# Altium project CryptUS_Daughterboard_Rev1_A.PrjPcb (part 1 of 2)
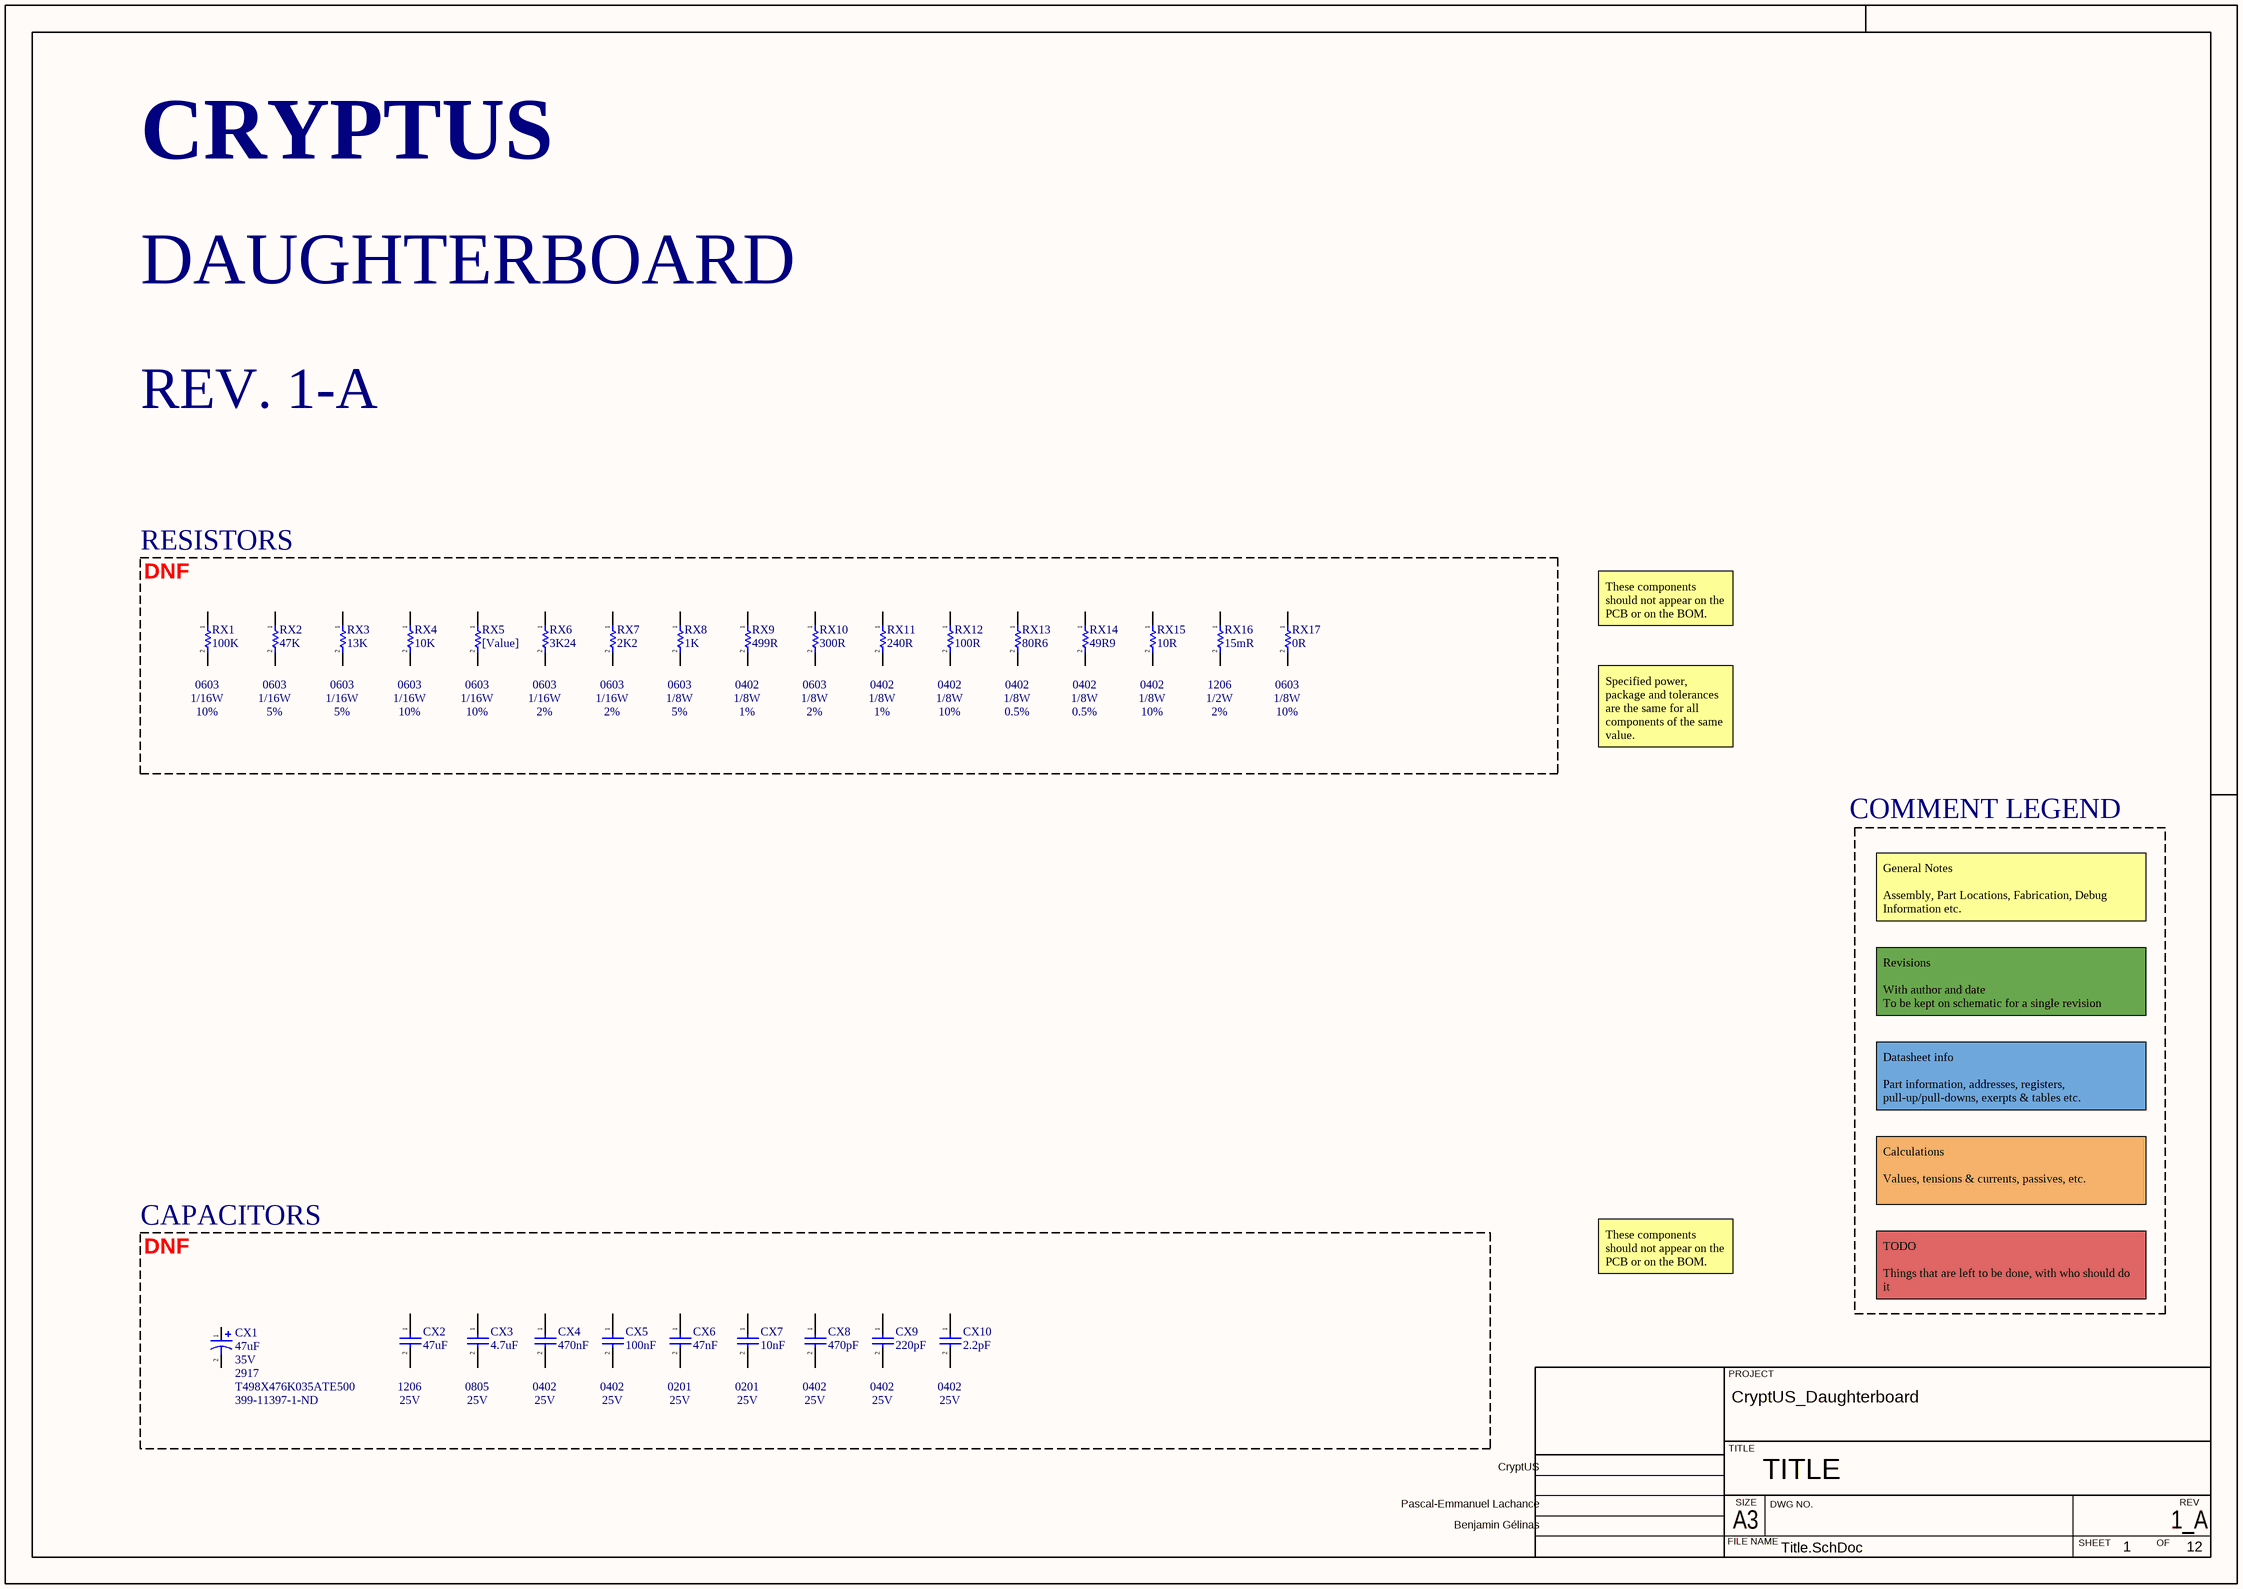
[diagram p0: Title.SchDoc]
ItemRevision: 1_A; NotFitted: DNF; Project: CryptUS_Daughterboard
12 sheets, 499 parts. Net scope: strictly hierarchical (ports join the sheet entries above them; power ports are local).
Board file: Daughterboard_Rev1_A.PcbDoc
Sheets:
  Title.SchDoc
  Overview.SchDoc
    FPGA = FPGA IO.SchDoc
    JTAG & FLASH = FPGA PERIPHERALS.SchDoc
    FPGA POWER = FPGA Power.SchDoc
    CONNECTORS = Mechanical and Interconnect.SchDoc
    DDR3 POWER REGULATOR = DDR3 Regulators.SchDoc
    MEM POWER 0 = DDR3 Power.SchDoc
    MEM 0 = DDR3.SchDoc
    DDR3 TERMINATION = DDR3 Termination.SchDoc
    USB0 = USB.SchDoc
    FPGA POWER REGULATOR = FPGA Regulators.SchDoc

## Sheet Title.SchDoc: TITLE
size 420 x 297 mm; Address1: CryptUS; Address3: Pascal-Emmanuel Lachance; Address4: Benjamin Gélinas; SheetNumber: 1; SheetTotal: 12

### Parts
CX1  47uF  Part #: T498X476K035ATE500  Rated Voltage: 35V  Supplier Part Number 1: 399-11397-1-ND  Package: 2917  [CAP_2917_P]
CX2  47uF  [CAP_1206]
CX3  4.7uF  [CAP_0805]
CX4  470nF  [CAP_0402]
CX5  100nF  [CAP_0402]
CX6  47nF  [CAP_0201]
CX7  10nF  [CAP_0201]
CX8  470pF  [CAP_0402]
CX9  220pF  [CAP_0402]
CX10  2.2pF  [CAP_0402]
RX1  100K  [RES_0603]
RX2  47K  [RES_0603]
RX3  13K  [RES_0603]
RX4  10K  [RES_0603]
RX5  [Value]  [RES_0603]
RX6  3K24  [RES_0603]
RX7  2K2  [RES_0603]
RX8  1K  [RES_0603]
RX9  499R  [RES_0402]
RX10  300R  [RES_0603]
RX11  240R  [RES_0402]
RX12  100R  [RES_0402]
RX13  80R6  [RES_0402]
RX14  49R9  [RES_0402]
RX15  10R  [RES_0402]
RX16  15mR  [RES_1206]
RX17  0R  [RES_0603]

### Blocks framed on the sheet
RESISTORS: RX1-RX17
CAPACITORS: CX1-CX10

### Nets

Not connected (* = marked no-connect by the designer): CX1 1 2; CX2 1 2; CX3 1 2; CX4 1 2; CX5 1 2; CX6 1 2; CX7 1 2; CX8 1 2; CX9 1 2; CX10 1 2; RX1 1 2; RX2 1 2; RX3 1 2; RX4 1 2; RX5 1 2; RX6 1 2; RX7 1 2; RX8 1 2; RX9 1 2; RX10 1 2; RX11 1 2; RX12 1 2; RX13 1 2; RX14 1 2; RX15 1 2; RX16 1 2; RX17 1 2

### Notes on the sheet
- CRYPTUS
- DAUGHTERBOARD
- REV. 1-A
- These components should not appear on the PCB or on the BOM.
- (near RX1) 0603
- (near RX1) 1/16W
- 10%
- (near RX2) 0603
- (near RX2) 1/16W
- 5%
- (near RX3) 0603
- (near RX3) 1/16W
- (near RX4) 0603
- (near RX4) 1/16W
- (near RX5) 0603
- (near RX5) 1/16W
- (near RX6) 0603
- (near RX6) 1/16W
- 2%
- (near RX7) 0603
- (near RX7) 1/16W
- (near RX8) 0603
- (near RX8) 1/8W
- (near RX9) 0402
- (near RX9) 1/8W
- 1%
- (near RX10) 0603
- (near RX10) 1/8W
- (near RX11) 0402
- (near RX11) 1/8W
- (near RX12) 0402
- (near RX12) 1/8W
- (near RX13) 0402
- (near RX13) 1/8W
- 0.5%
- (near RX14) 0402
- (near RX14) 1/8W
- (near RX15) 0402
- (near RX15) 1/8W
- (near RX16) 1206
- (near RX16) 1/2W
- (near RX17) 0603
- (near RX17) 1/8W
- Specified power, package and tolerances are the same for all components of the same value.
- COMMENT LEGEND
- General Notes
  Assembly, Part Locations, Fabrication, Debug Information etc.
- Revisions
  With author and date
  To be kept on schematic for a single revision
- Datasheet info
  Part information, addresses, registers, pull-up/pull-downs, exerpts & tables etc.
- Calculations
  Values, tensions & currents, passives, etc.
- TODO
  Things that are left to be done, with who should do it
- (near CX2) 1206
- (near CX2) 25V
- (near CX3) 0805
- (near CX3) 25V
- (near CX4) 0402
- (near CX4) 25V
- (near CX5) 0402
- (near CX5) 25V
- (near CX6) 0201
- (near CX6) 25V
- (near CX7) 0201
- (near CX7) 25V
- (near CX8) 0402
- (near CX8) 25V
- (near CX9) 0402
- (near CX9) 25V
- (near CX10) 0402
- (near CX10) 25V
- PROJECT
- TITLE
- FILE NAME
- A3
- SIZE
- DWG NO.
- SHEET
- OF
- REV

### Library data of the parts
CX1 = CAP_T498X476K035ATE500: 47 µF Molded Tantalum Capacitors 35 V 2917 (7343 Metric) 500mOhm; Mfr: KEMET; Tolerance: 10%; Operating Temperature: -55C - 150C; Supplier 1: Digi-Key
CX2-CX10 = CAP_CER: Generic SMT Ceramic Capacitor; Voltage - Rated: 25V; Operating Temperature: *; Tolerance: *; Mfr: *; ComponentLink1Description: Digikey; ComponentLink1URL: [Digikey Link]; Digikey Part No: *; ComponentLink2Description: Datasheet; ComponentLink2URL: [Datasheet Link]
  CX2: Footprint: 1206
  CX3: Footprint: 0805
  CX4 CX5 CX8-CX10: Footprint: 0402
  CX6 CX7: Footprint: 0201
RX1 RX4 = RESISTOR: Power: 1/16W; Tolerance: 10%; Automotive: *; Operating Temperature: *; # Digikey: *; ComponentLink1Description: Digikey; ComponentLink1URL: *; # Manufacturer: *; Package / Case: 0603
RX2 RX8 = RESISTOR: Power: 1/8W; Tolerance: 5%; Automotive: *; Operating Temperature: *; # Digikey: *; ComponentLink1Description: Digikey; ComponentLink1URL: *; # Manufacturer: *; Package / Case: 0603
RX3 = RESISTOR: Power: 1/16W; Tolerance: 5%; Automotive: *; Operating Temperature: *; # Digikey: *; ComponentLink1Description: Digikey; ComponentLink1URL: *; # Manufacturer: *; Package / Case: 0603
RX5 = RESISTOR: Power: [Power]; Tolerance: [Tolerance]; Automotive: *; Operating Temperature: *; # Digikey: *; ComponentLink1Description: Digikey; ComponentLink1URL: *; # Manufacturer: *; Package / Case: [Package]
RX6 RX7 = RESISTOR: Power: 1/16W; Tolerance: 2%; Automotive: *; Operating Temperature: *; # Digikey: *; ComponentLink1Description: Digikey; ComponentLink1URL: *; # Manufacturer: *; Package / Case: 0603
RX9 RX11 = RESISTOR: Power: 1/8W; Tolerance: 1%; Automotive: *; Operating Temperature: *; # Digikey: *; ComponentLink1Description: Digikey; ComponentLink1URL: *; # Manufacturer: *; Package / Case: 0402
RX10 = RESISTOR: Power: 1/8W; Tolerance: 2%; Automotive: *; Operating Temperature: *; # Digikey: *; ComponentLink1Description: Digikey; ComponentLink1URL: *; # Manufacturer: *; Package / Case: 0603
RX12 RX15 RX17 = RESISTOR: Power: 1/8W; Tolerance: 10%; Automotive: *; Operating Temperature: *; # Digikey: *; ComponentLink1Description: Digikey; ComponentLink1URL: *; # Manufacturer: *
  RX12 RX15: Package / Case: 0402
  RX17: Package / Case: 0603
RX13 RX14 = RESISTOR: Power: 1/8W; Tolerance: 0.5%; Automotive: *; Operating Temperature: *; Package / Case: 0402; # Digikey: *; ComponentLink1Description: Digikey; ComponentLink1URL: *; # Manufacturer: *
RX16 = RESISTOR: Power: 1/2W; Tolerance: 2%; Automotive: *; Operating Temperature: *; # Digikey: *; ComponentLink1Description: Digikey; ComponentLink1URL: *; # Manufacturer: *; Package / Case: 1206

## Sheet Overview.SchDoc
size A2; SheetNumber: 2; SheetTotal: 12
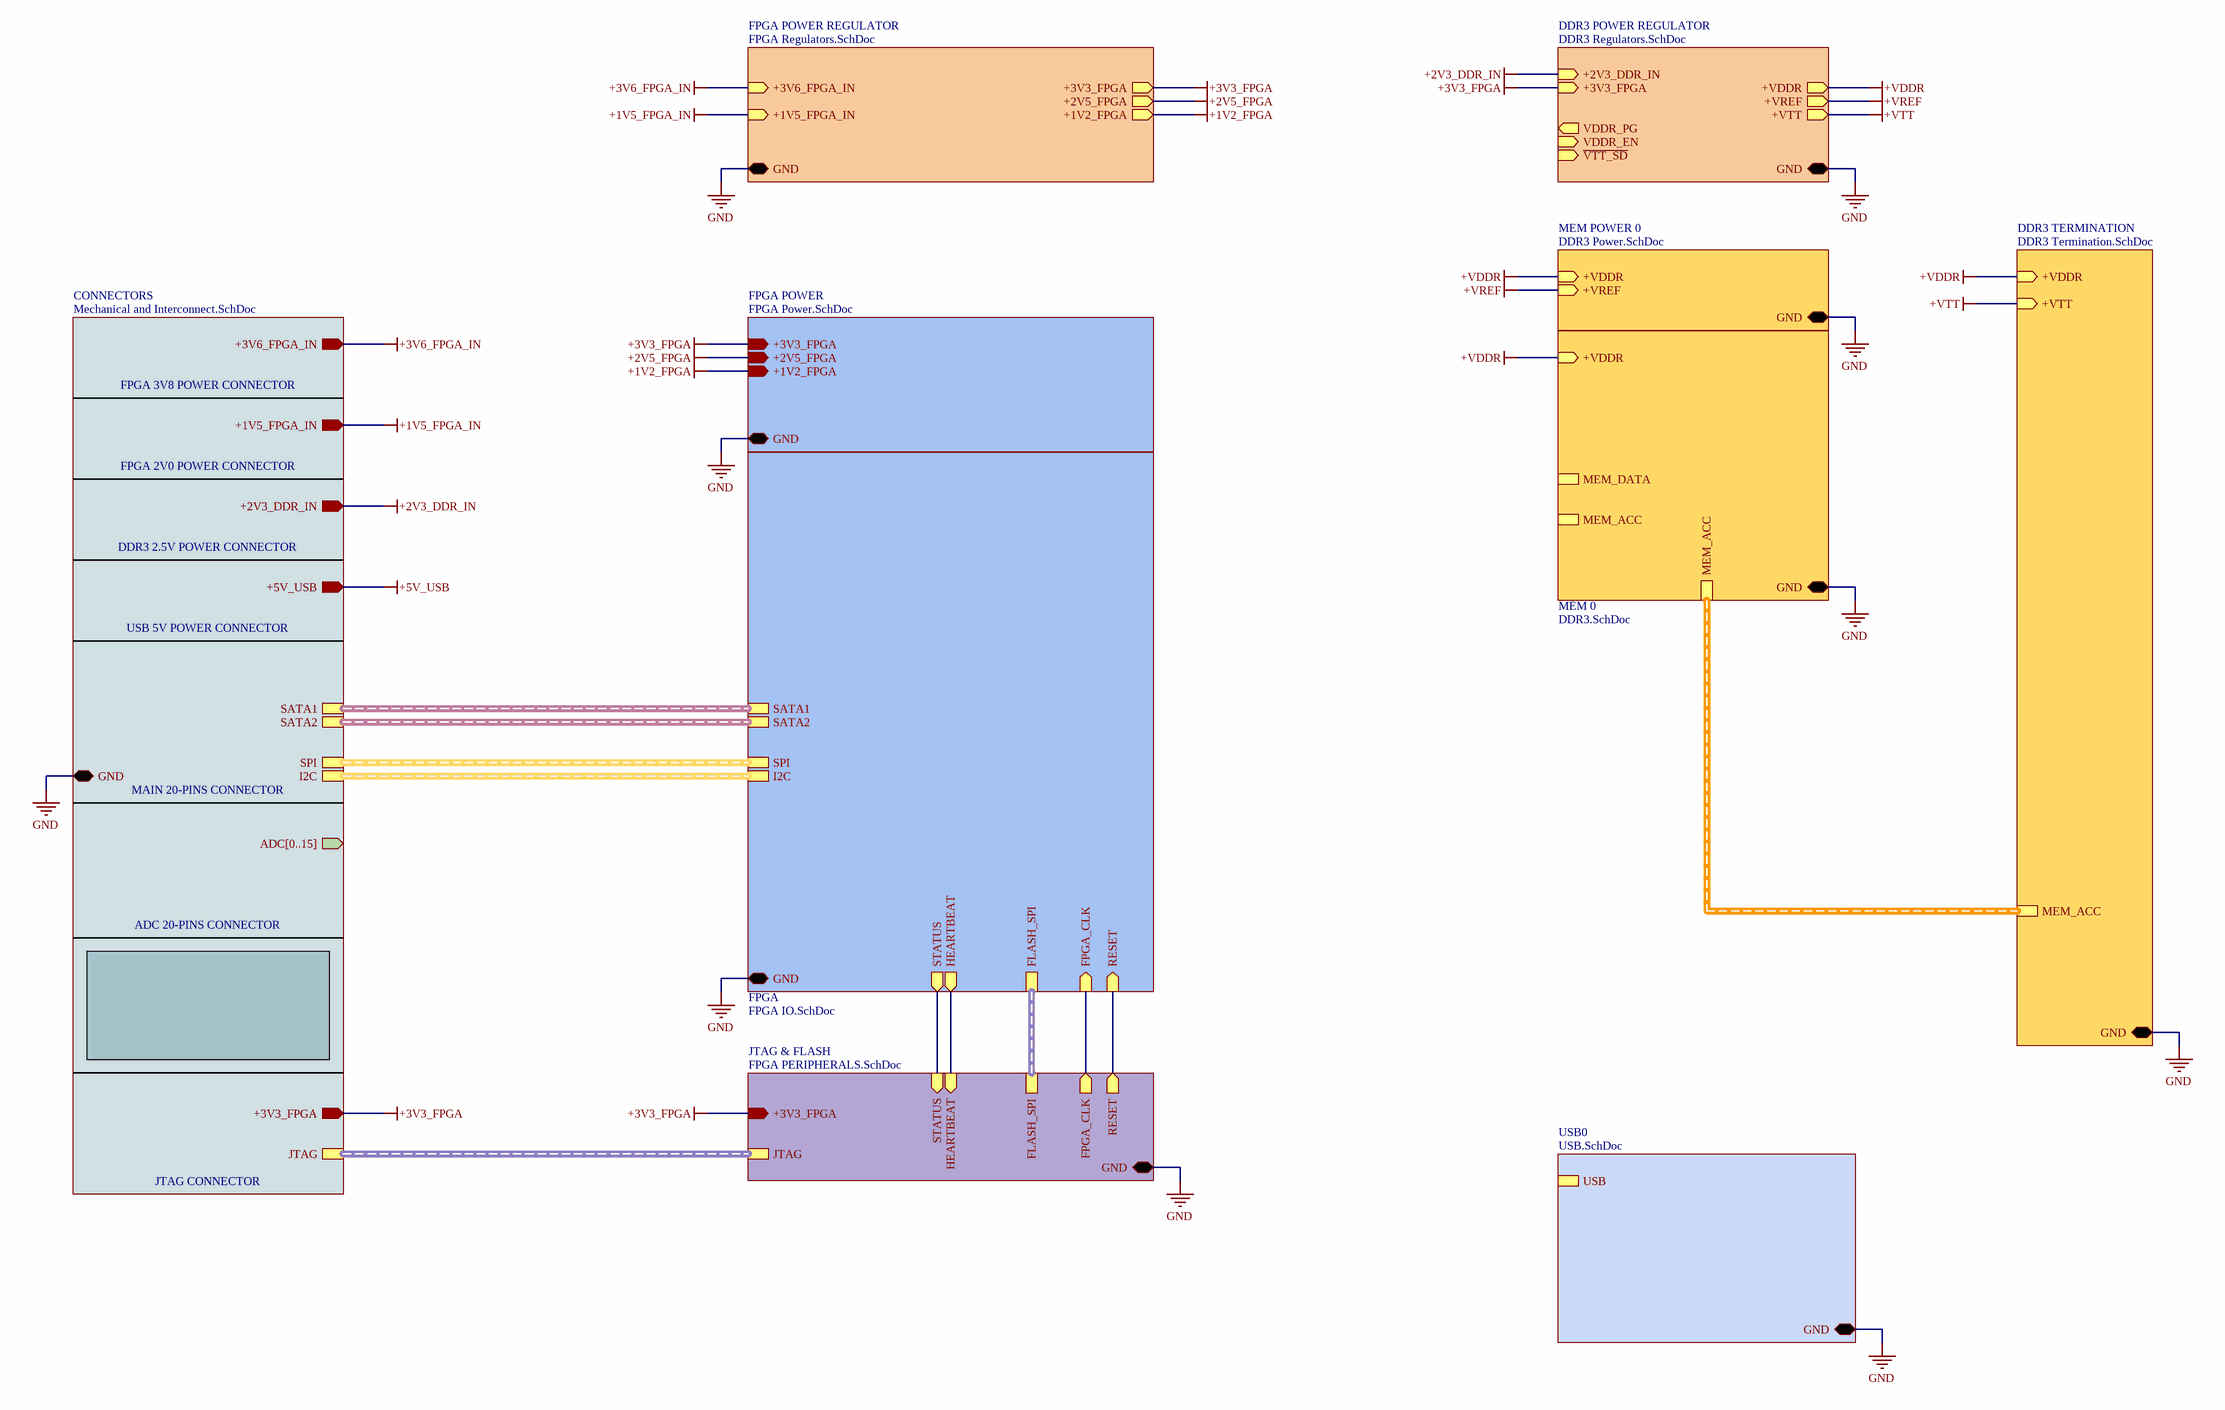
[diagram p1: Overview.SchDoc]

### Sub-sheets
CONNECTORS = Mechanical and Interconnect.SchDoc: JTAG (harness JTAG), SATA2 (harness SATA), ADC[0..15] (out), SPI (harness SPI), SATA1 (harness SATA), +5V_USB (out), +3V6_FPGA_IN (out), +3V3_FPGA (out), +2V3_DDR_IN (out), GND (bidir), I2C (harness I2C), +1V5_FPGA_IN (out)
DDR3 POWER REGULATOR = DDR3 Regulators.SchDoc: GND (bidir), VDDR_EN (in), +VDDR (out), +3V3_FPGA (in), +VREF (out), +VTT (out), ~{VTT_SD} (in), VDDR_PG (out), +2V3_DDR_IN (in)
DDR3 TERMINATION = DDR3 Termination.SchDoc: GND (bidir), +VTT (in), +VDDR (in), MEM_ACC (harness MEM_ACC)
FPGA = FPGA IO.SchDoc: FLASH_SPI (harness FLASH_SPI), GND (bidir), SATA2 (harness SATA), SPI (harness SPI), I2C (harness I2C), SATA1 (harness SATA), RESET (in), HEARTBEAT (out), STATUS (out), FPGA_CLK (in)
FPGA POWER = FPGA Power.SchDoc: GND (bidir), +3V3_FPGA (in), +2V5_FPGA (in), +1V2_FPGA (in)
FPGA POWER REGULATOR = FPGA Regulators.SchDoc: GND (bidir), +1V5_FPGA_IN (in), +3V6_FPGA_IN (in), +1V2_FPGA (out), +2V5_FPGA (out), +3V3_FPGA (out)
JTAG & FLASH = FPGA PERIPHERALS.SchDoc: JTAG (harness JTAG), FLASH_SPI (harness FLASH_SPI), +3V3_FPGA (in), GND (bidir), STATUS (in), HEARTBEAT (in), RESET (out), FPGA_CLK (out)
MEM 0 = DDR3.SchDoc: GND (bidir), +VDDR (in), MEM_DATA (harness MEM0_DATA), MEM_ACC (harness MEM_ACC), MEM_ACC (harness MEM_ACC)
MEM POWER 0 = DDR3 Power.SchDoc: GND (bidir), +VDDR (in), +VREF (in)
USB0 = USB.SchDoc: USB (harness USB), GND (bidir)

### Nets
+1V2_FPGA: sheet FPGA POWER/+1V2_FPGA, sheet FPGA POWER REGULATOR/+1V2_FPGA
+1V5_FPGA_IN: sheet CONNECTORS/+1V5_FPGA_IN, sheet FPGA POWER REGULATOR/+1V5_FPGA_IN
+2V3_DDR_IN: sheet CONNECTORS/+2V3_DDR_IN, sheet DDR3 POWER REGULATOR/+2V3_DDR_IN
+2V5_FPGA: sheet FPGA POWER/+2V5_FPGA, sheet FPGA POWER REGULATOR/+2V5_FPGA
+3V3_FPGA: sheet JTAG & FLASH/+3V3_FPGA, sheet FPGA POWER/+3V3_FPGA, sheet CONNECTORS/+3V3_FPGA, sheet DDR3 POWER REGULATOR/+3V3_FPGA, sheet FPGA POWER REGULATOR/+3V3_FPGA
+3V6_FPGA_IN: sheet CONNECTORS/+3V6_FPGA_IN, sheet FPGA POWER REGULATOR/+3V6_FPGA_IN
+VDDR: sheet DDR3 POWER REGULATOR/+VDDR, sheet MEM POWER 0/+VDDR, sheet MEM 0/+VDDR, sheet DDR3 TERMINATION/+VDDR
+VREF: sheet DDR3 POWER REGULATOR/+VREF, sheet MEM POWER 0/+VREF
+VTT: sheet DDR3 POWER REGULATOR/+VTT, sheet DDR3 TERMINATION/+VTT
GND: sheet FPGA/GND, sheet JTAG & FLASH/GND, sheet FPGA POWER/GND, sheet CONNECTORS/GND, sheet DDR3 POWER REGULATOR/GND, sheet MEM POWER 0/GND, sheet MEM 0/GND, sheet DDR3 TERMINATION/GND, sheet USB0/GND, sheet FPGA POWER REGULATOR/GND
HEARTBEAT: sheet FPGA/HEARTBEAT, sheet JTAG & FLASH/HEARTBEAT
RESET: sheet FPGA/RESET, sheet JTAG & FLASH/RESET
NetD9_2: sheet FPGA/STATUS, sheet JTAG & FLASH/STATUS
NetU1_L20: sheet FPGA/FPGA_CLK, sheet JTAG & FLASH/FPGA_CLK

### Buses and harness runs
harness sheet CONNECTORS/I2C = sheet FPGA/I2C
harness sheet CONNECTORS/JTAG = sheet JTAG & FLASH/JTAG
harness sheet CONNECTORS/SATA1 = sheet FPGA/SATA1
harness sheet CONNECTORS/SATA2 = sheet FPGA/SATA2
harness sheet CONNECTORS/SPI = sheet FPGA/SPI
harness sheet DDR3 TERMINATION/MEM_ACC = sheet MEM 0/MEM_ACC
harness sheet FPGA/FLASH_SPI = sheet JTAG & FLASH/FLASH_SPI

### Notes on the sheet
- FPGA 3V8 POWER CONNECTOR
- FPGA 2V0 POWER CONNECTOR
- DDR3 2.5V POWER CONNECTOR
- USB 5V POWER CONNECTOR
- MAIN 20-PINS CONNECTOR
- ADC 20-PINS CONNECTOR
- JTAG CONNECTOR

## Sheet FPGA IO.SchDoc
size 420 x 297 mm; SheetNumber: 4; SheetTotal: 12
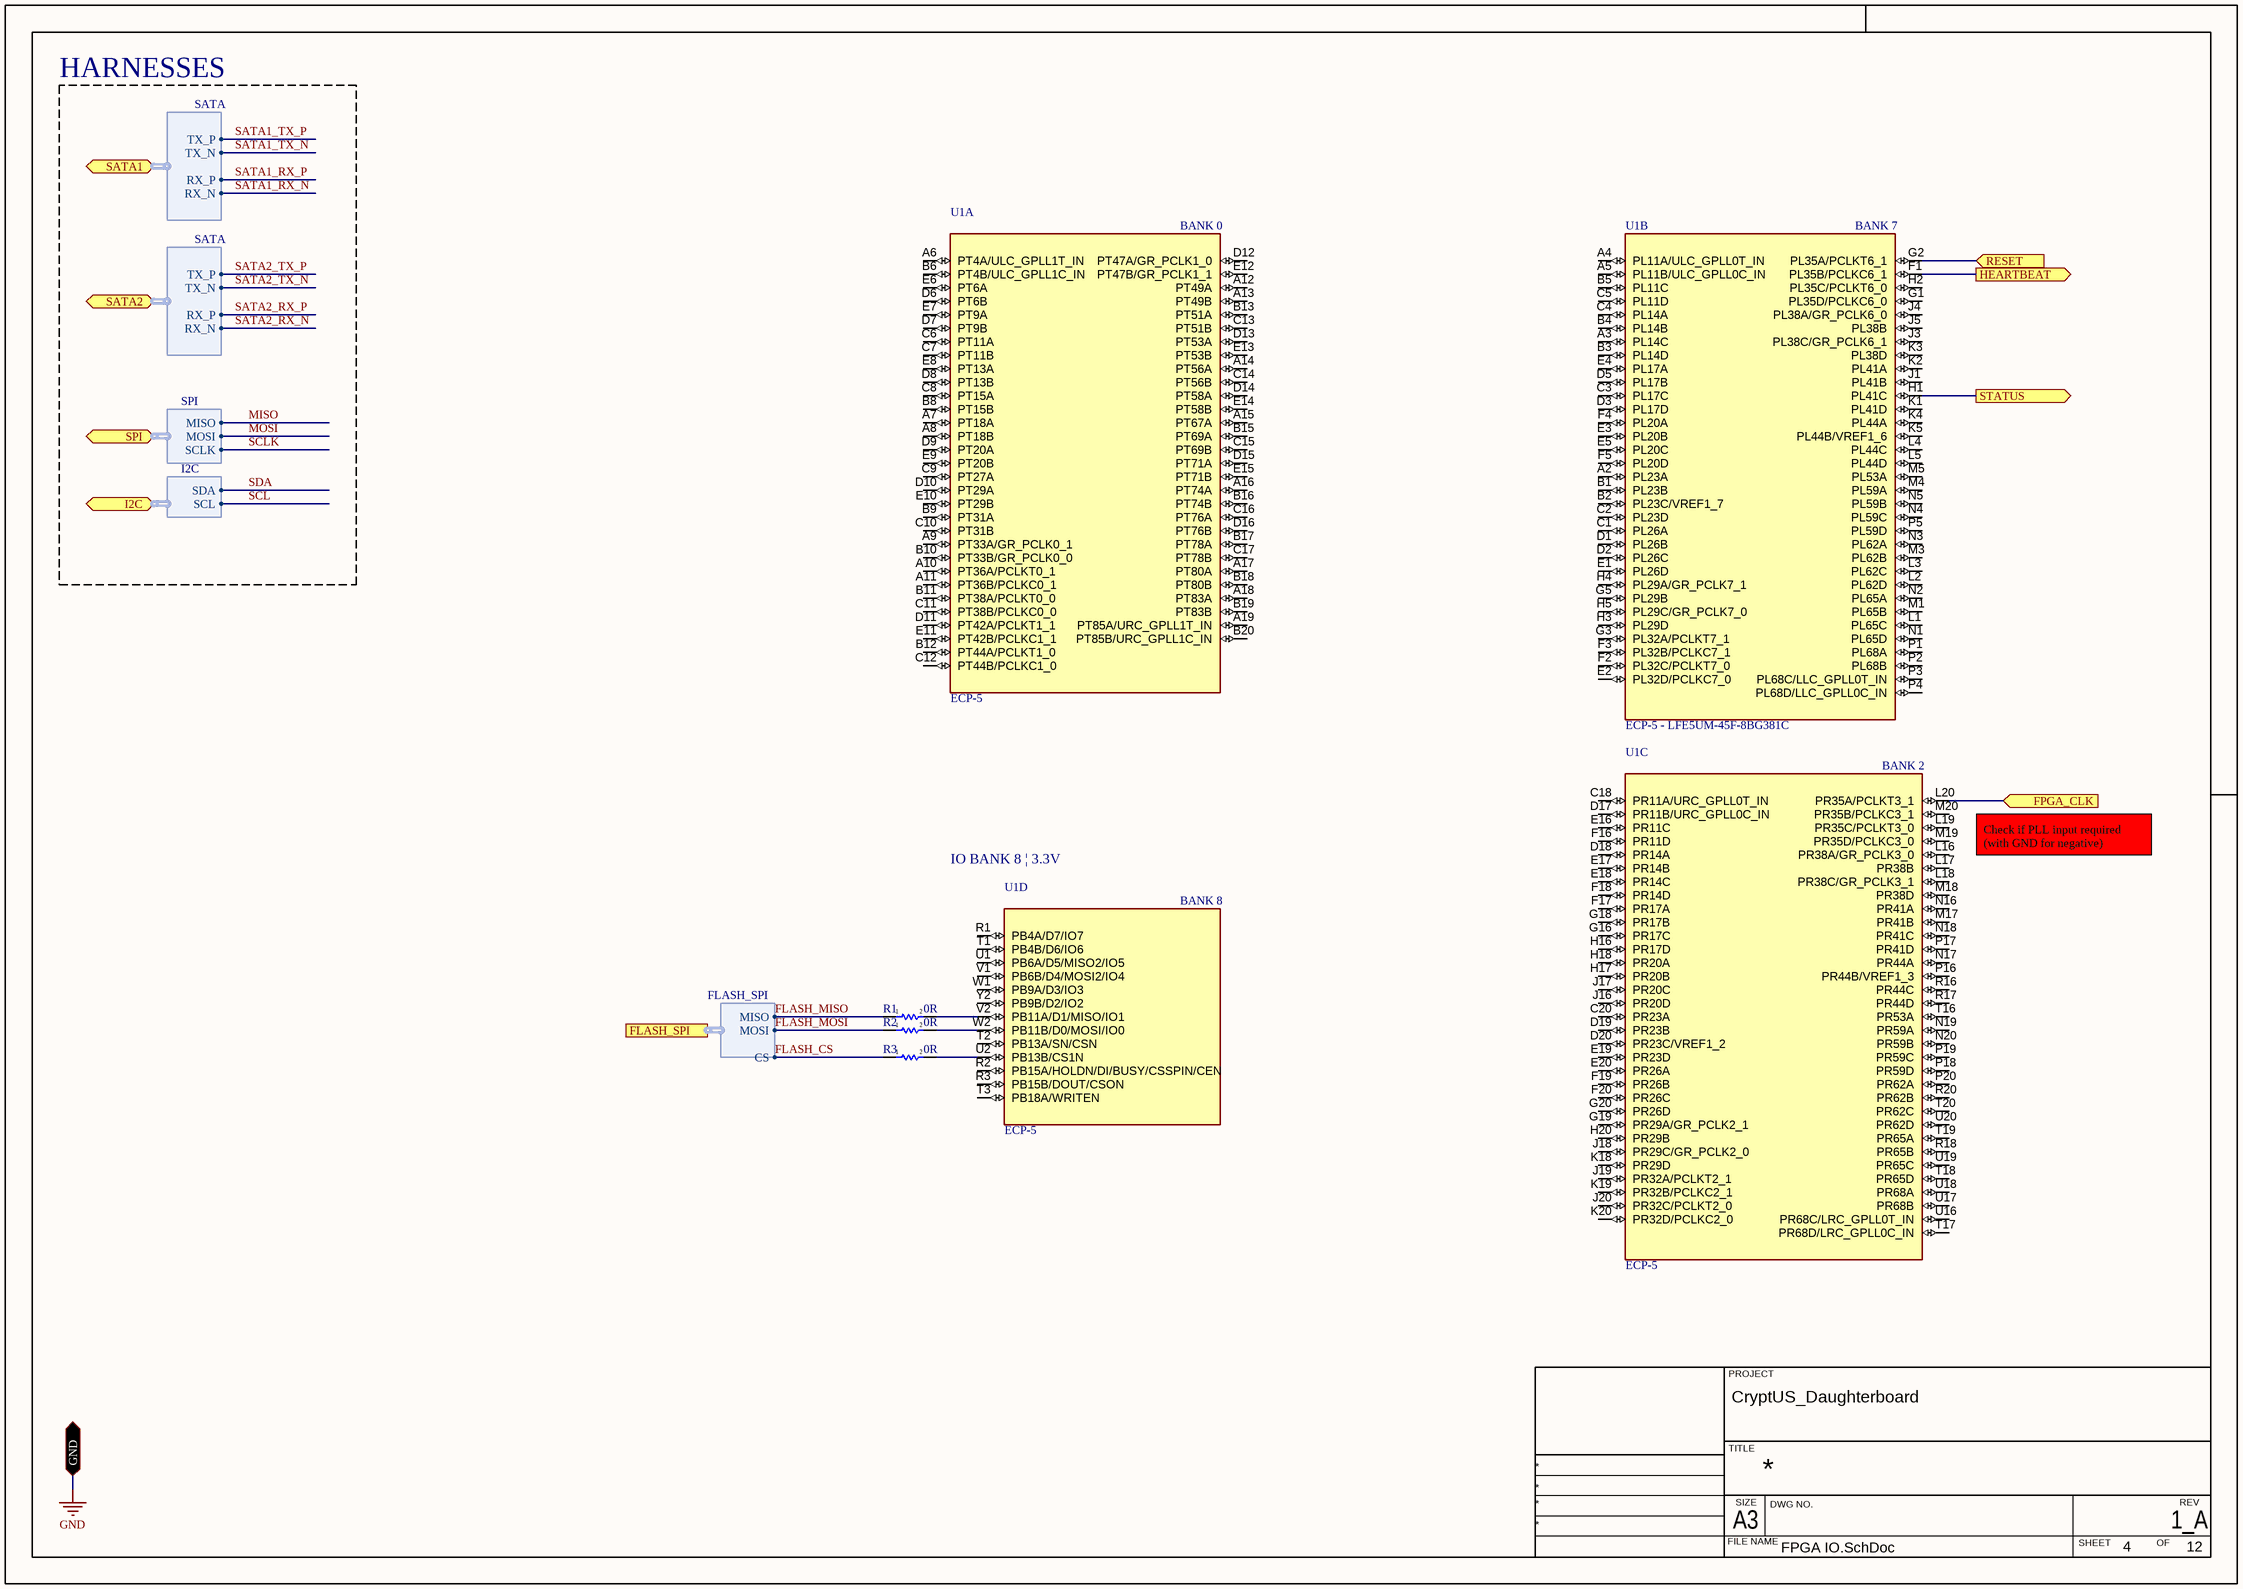
[diagram p2: FPGA IO.SchDoc]

### Parts
R1  0R  [RES_0603]
R2  0R  [RES_0603]
R3  0R  [RES_0603]
U1  ECP-5  [CABGA-381]  (parts A,B,C,D of 7)

### Ports
FLASH_SPI (harness FLASH_SPI), FPGA_CLK (in), GND (bidir), HEARTBEAT (out), I2C (bidir, harness I2C), RESET (in), SATA1 (bidir, harness SATA), SATA2 (bidir, harness SATA), SPI (bidir, harness SPI), STATUS (out)

### Harnesses
FLASH_SPI: MISO, MOSI, CS
SATA: TX_P, TX_N, RX_P, RX_N
I2C: SDA, SCL
SPI: MISO, MOSI, SCLK

### Nets
FLASH_CS: R3.1 ; port FLASH_SPI.CS
FLASH_MISO: R1.1 ; port FLASH_SPI.MISO
FLASH_MOSI: R2.1 ; port FLASH_SPI.MOSI
HEARTBEAT: U1.F1(PL35B/PCLKC6_1) ; port HEARTBEAT
RESET: U1.G2(PL35A/PCLKT6_1) ; port RESET
NetD9_2: U1.H1(PL41C) ; port STATUS
NetR1_2: R1.2 U1.V2(PB11A/D1/MISO/IO1)
NetR2_2: R2.2 U1.W2(PB11B/D0/MOSI/IO0)
NetR3_2: R3.2 U1.U2(PB13B/CS1N)
NetU1_L20: U1.L20(PR35A/PCLKT3_1) ; port FPGA_CLK

Not connected (* = marked no-connect by the designer): U1 A2(PL23A) A3(PL14C) A4(PL11A/ULC_GPLL0T_IN) A5(PL11B/ULC_GPLL0C_IN) A6(PT4A/ULC_GPLL1T_IN) A7(PT18A) A8(PT18B) A9(PT33A/GR_PCLK0_1) A10(PT36A/PCLKT0_1) A11(PT36B/PCLKC0_1) A12(PT49A) A13(PT49B) A14(PT56A) A15(PT67A) A16(PT74A) A17(PT80A) A18(PT83A) A19(PT85A/URC_GPLL1T_IN) B1(PL23B) B2(PL23C/VREF1_7) B3(PL14D) B4(PL14B) B5(PL11C) B6(PT4B/ULC_GPLL1C_IN) B8(PT15B) B9(PT31A) B10(PT33B/GR_PCLK0_0) B11(PT38A/PCLKT0_0) B12(PT44A/PCLKT1_0) B13(PT51A) B15(PT69A) B16(PT74B) B17(PT78A) B18(PT80B) B19(PT83B) B20(PT85B/URC_GPLL1C_IN) C1(PL26A) C2(PL23D) C3(PL17C) C4(PL14A) C5(PL11D) C6(PT11A) C7(PT11B) C8(PT15A) C9(PT27A) C10(PT31B) C11(PT38B/PCLKC0_0) C12(PT44B/PCLKC1_0) C13(PT51B) C14(PT56B) C15(PT69B) C16(PT76A) C17(PT78B) C18(PR11A/URC_GPLL0T_IN) C20(PR23A) D1(PL26B) D2(PL26C) D3(PL17D) D5(PL17B) D6(PT6B) D7(PT9B) D8(PT13B) D9(PT20A) D10(PT29A) D11(PT42A/PCLKT1_1) D12(PT47A/GR_PCLK1_0) D13(PT53A) D14(PT58A) D15(PT71A) D16(PT76B) D17(PR11B/URC_GPLL0C_IN) D18(PR14A) D19(PR23B) D20(PR23C/VREF1_2) E1(PL26D) E2(PL32D/PCLKC7_0) E3(PL20B) E4(PL17A) E5(PL20C) E6(PT6A) E7(PT9A) E8(PT13A) E9(PT20B) E10(PT29B) E11(PT42B/PCLKC1_1) E12(PT47B/GR_PCLK1_1) E13(PT53B) E14(PT58B) E15(PT71B) E16(PR11C) E17(PR14B) E18(PR14C) E19(PR23D) E20(PR26A) F2(PL32C/PCLKT7_0) F3(PL32B/PCLKC7_1) F4(PL20A) F5(PL20D) F16(PR11D) F17(PR17A) F18(PR14D) F19(PR26B) F20(PR26C) G1(PL35D/PCLKC6_0) G3(PL32A/PCLKT7_1) G5(PL29B) G16(PR17C) G18(PR17B) G19(PR29A/GR_PCLK2_1) G20(PR26D) H2(PL35C/PCLKT6_0) H3(PL29D) H4(PL29A/GR_PCLK7_1) H5(PL29C/GR_PCLK7_0) H16(PR17D) H17(PR20B) H18(PR20A) H20(PR29B) J1(PL41B) J3(PL38C/GR_PCLK6_1) J4(PL38A/GR_PCLK6_0) J5(PL38B) J16(PR20D) J17(PR20C) J18(PR29C/GR_PCLK2_0) J19(PR32A/PCLKT2_1) J20(PR32C/PCLKT2_0) K1(PL41D) K2(PL41A) K3(PL38D) K4(PL44A) K5(PL44B/VREF1_6) K18(PR29D) K19(PR32B/PCLKC2_1) K20(PR32D/PCLKC2_0) L1(PL65C) L2(PL62D) L3(PL62C) L4(PL44C) L5(PL44D) L16(PR38A/GR_PCLK3_0) L17(PR38B) L18(PR38C/GR_PCLK3_1) L19(PR35C/PCLKT3_0) M1(PL65B) M3(PL62B) M4(PL59A) M5(PL53A) M17(PR41B) M18(PR38D) M19(PR35D/PCLKC3_0) M20(PR35B/PCLKC3_1) N1(PL65D) N2(PL65A) N3(PL62A) N4(PL59C) N5(PL59B) N16(PR41A) N17(PR44A) N18(PR41C) N19(PR59A) N20(PR59B) P1(PL68A) P2(PL68B) P3(PL68C/LLC_GPLL0T_IN) P4(PL68D/LLC_GPLL0C_IN) P5(PL59D) P16(PR44B/VREF1_3) P17(PR41D) P18(PR59D) P19(PR59C) P20(PR62A) R1(PB4A/D7/IO7) R2(PB15A/HOLDN/DI/BUSY/CSSPIN/CEN) R3(PB15B/DOUT/CSON) R16(PR44C) R17(PR44D) R18(PR65B) R20(PR62B) T1(PB4B/D6/IO6) T2(PB13A/SN/CSN) T3(PB18A/WRITEN) T16(PR53A) T17(PR68D/LRC_GPLL0C_IN) T18(PR65D) T19(PR65A) T20(PR62C) U1(PB6A/D5/MISO2/IO5) U16(PR68C/LRC_GPLL0T_IN) U17(PR68B) U18(PR68A) U19(PR65C) U20(PR62D) V1(PB6B/D4/MOSI2/IO4) W1(PB9A/D3/IO3) Y2(PB9B/D2/IO2)

### Notes on the sheet
- HARNESSES
- IO BANK 8 | 3.3V
- Check if PLL input required
  (with GND for negative)
- PROJECT
- TITLE
- FILE NAME
- A3
- SIZE
- DWG NO.
- SHEET
- OF
- REV
- (in symbol IC_LFE5UM-45F-8BG381C, part A) BANK 0
- (in symbol IC_LFE5UM-45F-8BG381C, part B) BANK 7
- (in symbol IC_LFE5UM-45F-8BG381C, part C) BANK 2
- (in symbol IC_LFE5UM-45F-8BG381C, part D) BANK 8

### Library data of the parts
R1-R3 = RESISTOR: Power: 1/8W; Tolerance: 10%; Automotive: *; Operating Temperature: *; Package / Case: 0603; # Digikey: *; ComponentLink1Description: Digikey; ComponentLink1URL: *; # Manufacturer: *
U1 = IC_LFE5UM-45F-8BG381C: IC FPGA 203 I/O 381CABGA; Mfr: Lattice Semiconductors; Supply Voltage: 1.045V - 1.115V; LABs/CLBs: 11000; Logic Elements: 44000; IOs: 203; RAM Bits: 1990656; Operating Temperature: 0C - 85C; Package / Case: 381-CABGA

## Sheet FPGA PERIPHERALS.SchDoc
size 393 x 281 mm; SheetNumber: 5; SheetTotal: 12
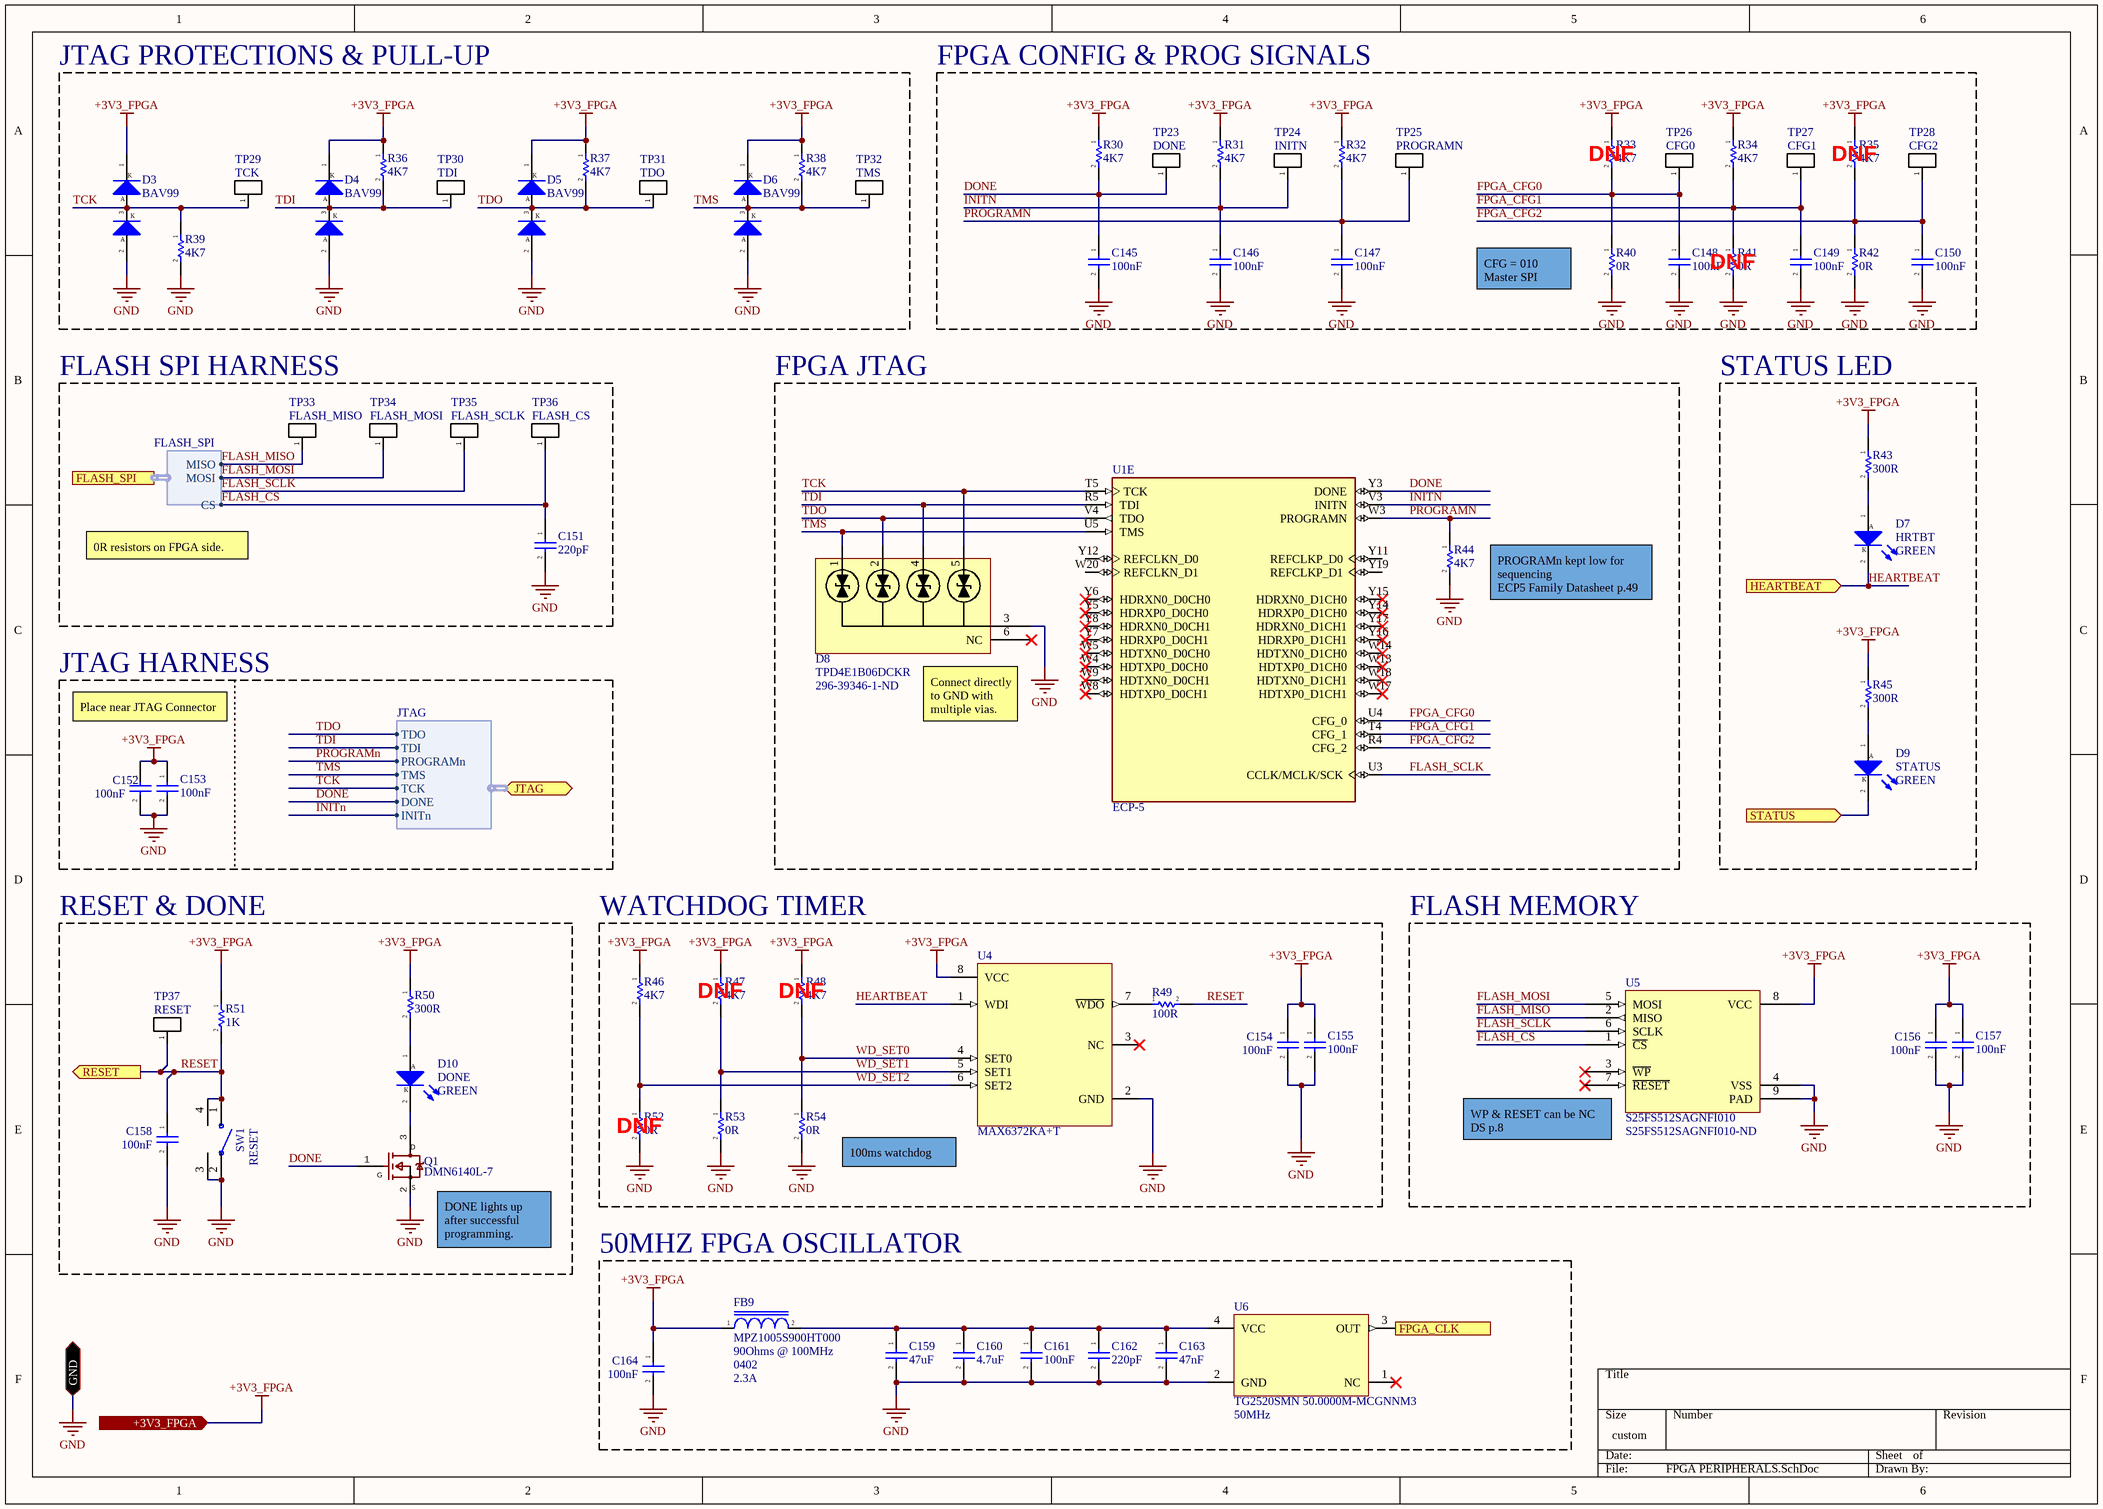
[diagram p3: FPGA PERIPHERALS.SchDoc]

### Parts
C145  100nF  [CAP_0402]
C146  100nF  [CAP_0402]
C147  100nF  [CAP_0402]
C148  100nF  [CAP_0402]
C149  100nF  [CAP_0402]
C150  100nF  [CAP_0402]
C151  220pF  [CAP_0402]
C152  100nF  [CAP_0402]
C153  100nF  [CAP_0402]
C154  100nF  [CAP_0402]
C155  100nF  [CAP_0402]
C156  100nF  [CAP_0402]
C157  100nF  [CAP_0402]
C158  100nF  [CAP_0402]
C159  47uF  [CAP_1206]
C160  4.7uF  [CAP_0805]
C161  100nF  [CAP_0402]
C162  220pF  [CAP_0402]
C163  47nF  [CAP_0201]
C164  100nF  [CAP_0402]
D3  BAV99  [MMBD7000-7-F]
D4  BAV99  [MMBD7000-7-F]
D5  BAV99  [MMBD7000-7-F]
D6  BAV99  [MMBD7000-7-F]
D7  HRTBT  Color: GREEN  [LED_0402]
D8  TPD4E1B06DCKR  Supplier Part Number 1: 296-39346-1-ND  [TPD4E1B06DCKR]
D9  STATUS  Color: GREEN  [LED_0402]
D10  DONE  Color: GREEN  [LED_0402]
FB9  MPZ1005S900HT000  Impedance @ Freq: 90Ohms @ 100MHz  Package / Case: 0402  Current Rating: 2.3A  [IND_0402]
Q1  DMN6140L-7  [SOT23-3]
R30  4K7  [RES_0603]
R31  4K7  [RES_0603]
R32  4K7  [RES_0603]
R33  4K7  [RES_0603]
R34  4K7  [RES_0603]
R35  4K7  [RES_0603]
R36  4K7  [RES_0603]
R37  4K7  [RES_0603]
R38  4K7  [RES_0603]
R39  4K7  [RES_0603]
R40  0R  [RES_0603]
R41  0R  [RES_0603]
R42  0R  [RES_0603]
R43  300R  [RES_0603]
R44  4K7  [RES_0603]
R45  300R  [RES_0603]
R46  4K7  [RES_0603]
R47  4K7  [RES_0603]
R48  4K7  [RES_0603]
R49  100R  [RES_0402]
R50  300R  [RES_0603]
R51  1K  [RES_0603]
R52  0R  [RES_0603]
R53  0R  [RES_0603]
R54  0R  [RES_0603]
SW1  RESET  [KMR621NGLFS]
TP23  DONE  [TP_PAD_TINY]  (no BOM)
TP24  INITN  [TP_PAD_TINY]  (no BOM)
TP25  PROGRAMN  [TP_PAD_TINY]  (no BOM)
TP26  CFG0  [TP_PAD_TINY]  (no BOM)
TP27  CFG1  [TP_PAD_TINY]  (no BOM)
TP28  CFG2  [TP_PAD_TINY]  (no BOM)
TP29  TCK  [TP_PAD_SMALL]  (no BOM)
TP30  TDI  [TP_PAD_SMALL]  (no BOM)
TP31  TDO  [TP_PAD_SMALL]  (no BOM)
TP32  TMS  [TP_PAD_SMALL]  (no BOM)
TP33  FLASH_MISO  [TP_PAD_SMALL]  (no BOM)
TP34  FLASH_MOSI  [TP_PAD_SMALL]  (no BOM)
TP35  FLASH_SCLK  [TP_PAD_SMALL]  (no BOM)
TP36  FLASH_CS  [TP_PAD_SMALL]  (no BOM)
TP37  RESET  [TP_PAD_SMALL]  (no BOM)
U1  ECP-5  [CABGA-381]  (part E of 7)
U4  MAX6372KA+T  [SOT23-8]
U5  S25FS512SAGNFI010  Supplier Part Number 1: S25FS512SAGNFI010-ND  [s25FL256LAGNFV010]
U6  TG2520SMN 50.0000M-MCGNNM3  Frequency: 50MHz  [TG2520SMN]

### Blocks framed on the sheet
JTAG PROTECTIONS & PULL-UP: D3-D6 R36-R39 TP29-TP32
FPGA CONFIG & PROG SIGNALS: C145-C150 R30-R35 R40-R42 TP23-TP28
FLASH SPI HARNESS: C151 TP33-TP36
FPGA JTAG: D8 R44 U1
STATUS LED: D7 D9 R43 R45
JTAG HARNESS: C152 C153
RESET & DONE: C158 D10 Q1 R50 R51 SW1 TP37
WATCHDOG TIMER: C154 C155 R46-R49 R52-R54 U4
FLASH MEMORY: C156 C157 U5
50MHZ FPGA OSCILLATOR: C159-C164 FB9 U6

### Ports
+3V3_FPGA (in), FLASH_SPI (harness FLASH_SPI), FPGA_CLK (out), GND (bidir), HEARTBEAT (in), JTAG (bidir, harness JTAG), RESET (out), STATUS (in)

### Harnesses
JTAG: TDO, TDI, PROGRAMn, TMS, TCK, DONE, INITn
FLASH_SPI: MISO, MOSI, CS

### Nets
+3V3_FPGA: C152.1 C153.1 C154.1 C155.1 C156.1 C157.1 C164.1 D3.1(K) D4.1(K) D5.1(K) D6.1(K) FB9.1 R30.1 R31.1 R32.1 R33.1 R34.1 R35.1 R36.1 R37.1 R38.1 R43.1 R45.1 R46.1 R47.1 R48.1 R50.1 R51.1 U4.8(VCC) U5.8(VCC) ; port +3V3_FPGA
GND: C145.2 C146.2 C147.2 C148.2 C149.2 C150.2 C151.2 C152.2 C153.2 C154.2 C155.2 C156.2 C157.2 C158.2 C159.2 C160.2 C161.2 C162.2 C163.2 C164.2 D3.2(K) D4.2(K) D5.2(K) D6.2(K) D8.3(GND) Q1.2 R39.2 R40.2 R41.2 R42.2 R44.2 R52.2 R53.2 R54.2 SW1.2 SW1.3 U4.2(GND) U5.4(VSS) U5.9(PAD) U6.2(GND) ; port GND
DONE: C145.1 Q1.1 R30.2 TP23.1(A) U1.Y3(DONE) ; port JTAG.DONE
FLASH_CS: C151.1 TP36.1(A) U5.1(~{CS}) ; port FLASH_SPI.CS
FLASH_MISO: TP33.1(A) U5.2(MISO) ; port FLASH_SPI.MISO
FLASH_MOSI: TP34.1(A) U5.5(MOSI) ; port FLASH_SPI.MOSI
FLASH_SCLK: TP35.1(A) U1.U3(CCLK/MCLK/SCK) U5.6(SCLK)
FPGA_CFG0: C148.1 R33.2 R40.1 TP26.1(A) U1.U4(CFG_0)
FPGA_CFG1: C149.1 R34.2 R41.1 TP27.1(A) U1.T4(CFG_1)
FPGA_CFG2: C150.1 R35.2 R42.1 TP28.1(A) U1.R4(CFG_2)
HEARTBEAT: D7.2(K) U4.1(WDI) ; port HEARTBEAT
INITN: C146.1 R31.2 TP24.1(A) U1.V3(INITN) ; port JTAG.INITn
PROGRAMN: C147.1 R32.2 R44.1 TP25.1(A) U1.W3(PROGRAMN) ; port JTAG.PROGRAMn
RESET: C158.1 R49.2 R51.2 SW1.1 SW1.4 TP37.1(A) ; port RESET
TCK: D3.3(A) D8.5(A) R39.1 TP29.1(A) U1.T5(TCK) ; port JTAG.TCK
TDI: D4.3(A) D8.4(A) R36.2 TP30.1(A) U1.R5(TDI) ; port JTAG.TDI
TDO: D5.3(A) D8.2(A) R37.2 TP31.1(A) U1.V4(TDO) ; port JTAG.TDO
TMS: D6.3(A) D8.1(A) R38.2 TP32.1(A) U1.U5(TMS) ; port JTAG.TMS
WD_SET0: R48.2 R54.1 U4.4(SET0)
WD_SET1: R47.2 R53.1 U4.5(SET1)
WD_SET2: R46.2 R52.1 U4.6(SET2)
NetC159_1: C159.1 C160.1 C161.1 C162.1 C163.1 FB9.2 U6.4(VCC)
NetD7_1: D7.1(A) R43.2
NetD9_1: D9.1(A) R45.2
NetD9_2: D9.2(K) ; port STATUS
NetD10_1: D10.1(A) R50.2
NetD10_2: D10.2(K) Q1.3
NetR49_1: R49.1 U4.7(~{WDO})
NetU1_L20: U6.3(OUT) ; port FPGA_CLK

Not connected (* = marked no-connect by the designer): D8 6(NC)*; U1 W4(HDTXP0_D0CH0)* W5(HDTXN0_D0CH0)* W8(HDTXP0_D0CH1)* W9(HDTXN0_D0CH1)* W13(HDTXP0_D1CH0)* W14(HDTXN0_D1CH0)* W17(HDTXP0_D1CH1)* W18(HDTXN0_D1CH1)* W20(REFCLKN_D1) Y5(HDRXP0_D0CH0)* Y6(HDRXN0_D0CH0)* Y7(HDRXP0_D0CH1)* Y8(HDRXN0_D0CH1)* Y11(REFCLKP_D0) Y12(REFCLKN_D0) Y14(HDRXP0_D1CH0)* Y15(HDRXN0_D1CH0)* Y16(HDRXP0_D1CH1)* Y17(HDRXN0_D1CH1)* Y19(REFCLKP_D1); U4 3(NC)*; U5 3(~{WP})* 7(~{RESET})*; U6 1(NC)*

### Notes on the sheet
- (near R40) CFG = 010
  Master SPI
- 0R resistors on FPGA side.
- (near R44) PROGRAMn kept low for sequencing
  ECP5 Family Datasheet p.49
- Place near JTAG Connector
- (near D8) Connect directly to GND with multiple vias.
- 100ms watchdog
- (near U5) WP & RESET can be NC
  DS p.8
- (near Q1) DONE lights up after successful programming.
- (in symbol TRANS_DMN6140L-7) D; G; S

### Library data of the parts
C145-C164 = CAP_CER: as CX2 on sheet Title; Operating Temperature: *; Tolerance: *; Mfr: *; ComponentLink1Description: Digikey; ComponentLink1URL: [Digikey Link]; Digikey Part No: *; ComponentLink2Description: Datasheet; ComponentLink2URL: [Datasheet Link]
  C145-C158 C161 C162 C164: Footprint: 0402
  C159: Footprint: 1206
  C160: Footprint: 0805
  C163: Footprint: 0201
D3-D6 = DIODE_BAV99: DIODE ARRAY GP 75V 300MA SOT23-3; Mfr: Taiwan Semiconductor Corporation; Diode Configuration: 1 Pair Series Connection; Current: 200mA; DC Reverse Voltage: 70V; Operating Temperature: -55C - 150C; Footprint: SOT-23
D7 D9 D10 = DIODE_LED: Generic LED; Forward Voltage: *; Wavelength: *
D8 = DIODE_TPD4E1B06DCKR: TVS DIODE 5.5VWM 14.5VC SC70-6; Mfr: Texas Instruments; Voltage - Reverse: 5.5V; Breakdown Voltage: 7V; Clamping Voltage: 14.5V; Current Peak (10/1ms): 3A; Power Peak: 45W; Operating Temperature: -40C - 125C; Supplier 1: Digi-Key
FB9 = IND_MPZ1005S900HT000: 90 Ohms @ 100 MHz 1 Power Line Ferrite Bead 0402 (1005 Metric) 2.3A 38mOhm; Resistance: 38mOhms; Operating Temperature: -55C - 125C; Rating: AEC-Q200
Q1 = TRANS_DMN6140L-7: N-Channel 60 V 1.6A (Ta) 700mW (Ta) Surface Mount SOT-23; Mfr: Diodes Incorporated; Vds: 60V; Rds ON: 140mR; Vgs: 3V; Package / Case: SOT-23; Operating Temperature: -55C - 150C; Current: 1.6A
R30-R39 R44 R46-R48 = RESISTOR: Power: 1/16W; Tolerance: 10%; Automotive: *; Operating Temperature: *; # Digikey: *; ComponentLink1Description: Digikey; ComponentLink1URL: *; # Manufacturer: *; Package / Case: 0603
R40-R42 R49 R52-R54 = RESISTOR: Power: 1/8W; Tolerance: 10%; Automotive: *; Operating Temperature: *; # Digikey: *; ComponentLink1Description: Digikey; ComponentLink1URL: *; # Manufacturer: *
  R40-R42 R52-R54: Package / Case: 0603
  R49: Package / Case: 0402
R43 R45 R50 = RESISTOR: Power: 1/8W; Tolerance: 2%; Automotive: *; Operating Temperature: *; # Digikey: *; ComponentLink1Description: Digikey; ComponentLink1URL: *; # Manufacturer: *; Package / Case: 0603
R51 = RESISTOR: Power: 1/8W; Tolerance: 5%; Automotive: *; Operating Temperature: *; # Digikey: *; ComponentLink1Description: Digikey; ComponentLink1URL: *; # Manufacturer: *; Package / Case: 0603
SW1 = SW_KMR621NG_LFS: Tactile Switch SPST-NO Top Actuated Surface Mount; Mfr: C&K; Alternative Part: KMR641NG ULC LFS; Contact Rating: 50mA @ 32V; Type: SPST-NO; Operating Temperature: -40C to 85C; Supplier 1: Newark; Supplier Part Number 1: 35AH0964; Digikey #: CKN10686CT-ND; ComponentLink1Description: Digikey; ComponentLink1URL: https://www.digikey.ca/en/products/detail/c-k/KMR641NG-ULC-LFS/6035352; ComponentLink2Description: Datasheet; ComponentLink2URL: https://www.ckswitches.com/media/1907/kmr6.pdf
TP23-TP37 = TESTPOINT: Test Point
U1 = IC_LFE5UM-45F-8BG381C: as U1 on sheet FPGA IO; Operating Temperature: 0C - 85C; Package / Case: 381-CABGA
U4 = IC_MAX6372KA-T: Watchdog Push-Pull, Totem Pole 1 Channel SOT-23-8; Mfr: Maxim Integrated; Timeout: Adjustable 1ms - 10s; Temperature: -40C - 125C; Supplier 1: Mouser; ComponentLink1Description: Digikey; ComponentLink1URL: https://www.digikey.ca/en/products/detail/analog-devices-inc-maxim-integrated/MAX6372KA-T/1518602; ComponentLink2Description: Datasheet; ComponentLink2URL: https://datasheets.maximintegrated.com/en/ds/MAX6369-MAX6374.pdf; Supplier Part Number 1: 700-MAX6372KAT
U5 = IC_S25FS512SAGNFI010: FLASH - NOR Memory IC 512Mb (64M x 8) SPI - Quad I/O, QPI 133 MHz 8-WSON (6x8); Mfr: Cypress; Memory Size: 512Mbits; Clock Frequency: 133MHz; Supply Voltage: 2.7V - 3.6V; Supplier 1: Digi-Key; Package: WSON-8 (8x6); Operating Temperature: -40C - 105C; ComponentLink1Description: Digikey; ComponentLink1URL: https://www.digikey.ca/en/products/detail/cypress-semiconductor-corp/S25FS512SAGNFI010/6596268; ComponentLink2Description: Datasheet; ComponentLink2URL: https://www.infineon.com/dgdl/Infineon-S25FS512S_512_Mb_1.8_V_Serial_Peripheral_Interface_with_Multi-I_O_Non-Volatile_Flash-DataSheet-v14_00-EN.pdf?fileId=8ac78c8c7d0d8da4017d0ed681a356fe&utm_source=cypress&utm_medium=referral&utm_campaign=202110_globe_en_all_integration-files
U6 = IC_TG2520SMN_50.0000M-MCGNNM3: 50 MHz TCXO Clipped Sine Wave Oscillator 2.8V ~ 3.3V - 4-SMD, No Lead; Mfr: EPSON; Supply Voltage: 2.8V - 3.3V; Frequency Stability: 500ppb; Supply Current: 2mA; Type: TCXO; Operating Temperature: -40C to 85C; Supplier 1: Digi-Key; Supplier Part Number 1: 114-TG2520SMN50.0000M-MCGNNM3CT-ND; ComponentLink1Description: Digikey; ComponentLink1URL: https://www.digikey.ca/en/products/detail/epson/TG2520SMN-50-0000M-MCGNNM3/13151939; ComponentLink2Description: Datasheet; ComponentLink2URL: https://support.epson.biz/td/api/doc_check.php?dl=brief_TG2520SMN&lang=en; ComponentLink3Description: Manufacturer; ComponentLink3URL: https://www5.epsondevice.com/en/products/tcxo/tg2520smn.html

## Sheet FPGA Power.SchDoc
size A2; SheetNumber: 6; SheetTotal: 12
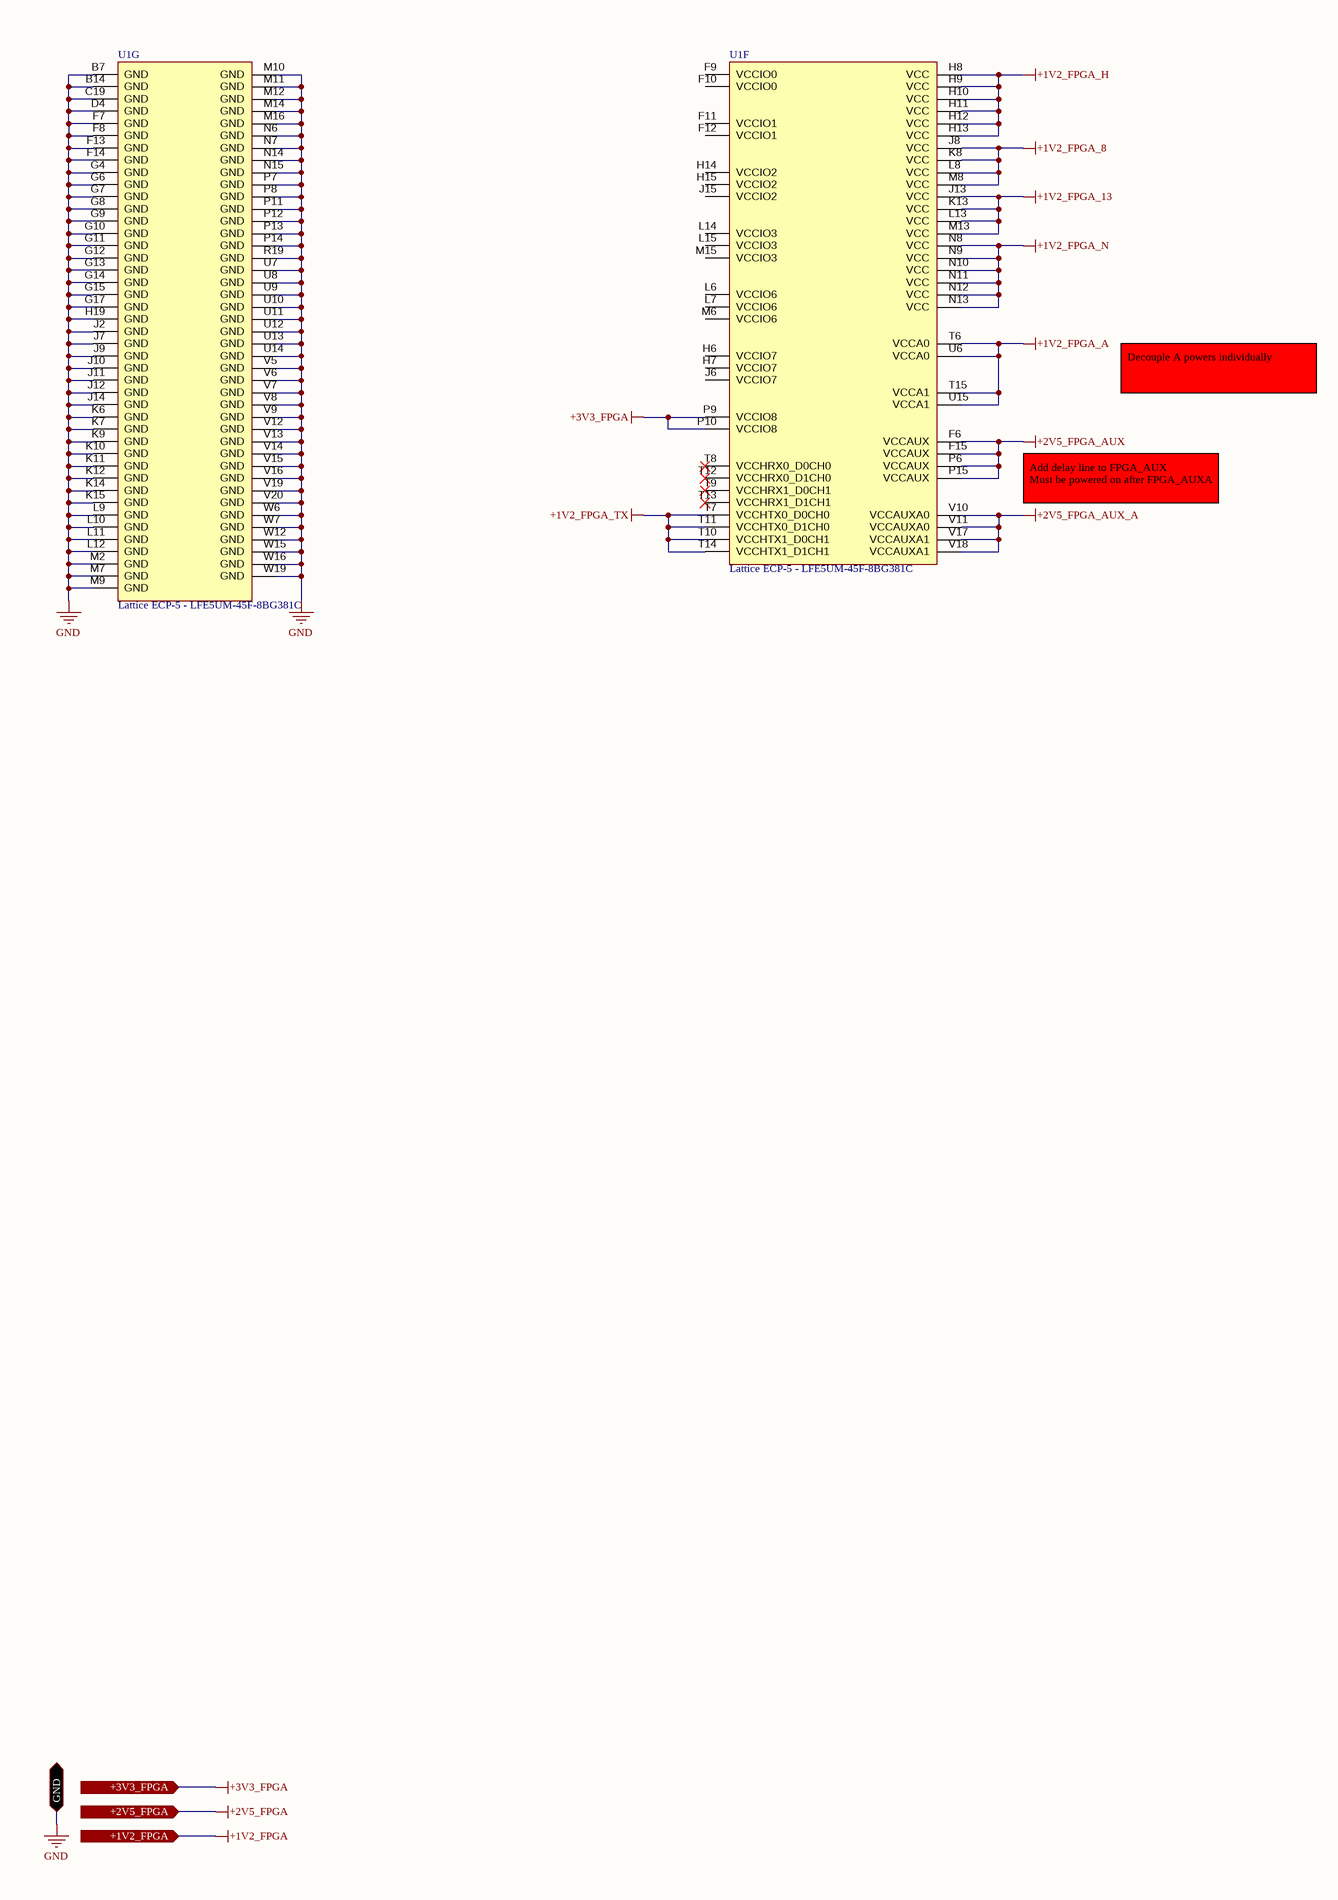
[diagram p4: FPGA Power.SchDoc, left]
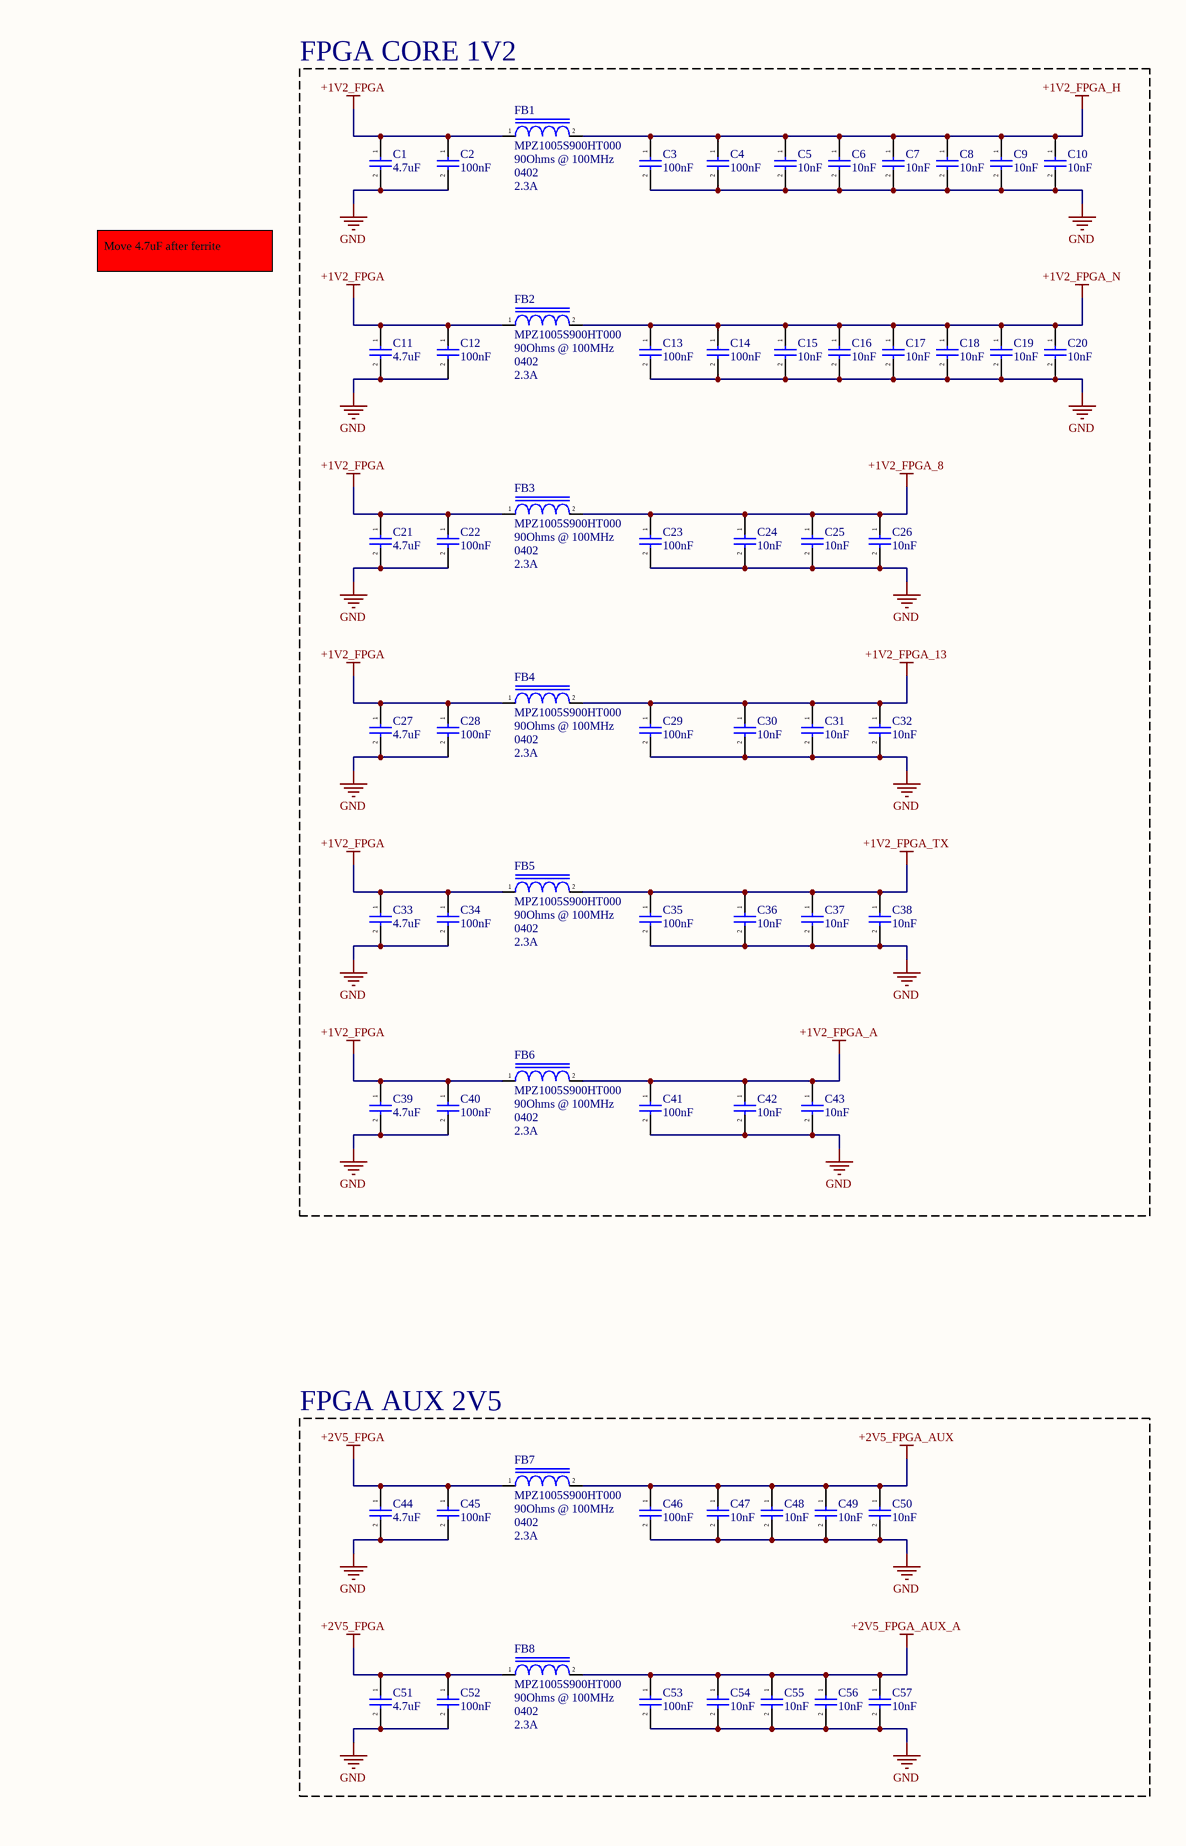
[diagram p5: FPGA Power.SchDoc, right]

### Parts
C1  4.7uF  [CAP_0805]
C2  100nF  [CAP_0402]
C3  100nF  [CAP_0402]
C4  100nF  [CAP_0402]
C5  10nF  [CAP_0201]
C6  10nF  [CAP_0201]
C7  10nF  [CAP_0201]
C8  10nF  [CAP_0201]
C9  10nF  [CAP_0201]
C10  10nF  [CAP_0201]
C11  4.7uF  [CAP_0805]
C12  100nF  [CAP_0402]
C13  100nF  [CAP_0402]
C14  100nF  [CAP_0402]
C15  10nF  [CAP_0201]
C16  10nF  [CAP_0201]
C17  10nF  [CAP_0201]
C18  10nF  [CAP_0201]
C19  10nF  [CAP_0201]
C20  10nF  [CAP_0201]
C21  4.7uF  [CAP_0805]
C22  100nF  [CAP_0402]
C23  100nF  [CAP_0402]
C24  10nF  [CAP_0201]
C25  10nF  [CAP_0201]
C26  10nF  [CAP_0201]
C27  4.7uF  [CAP_0805]
C28  100nF  [CAP_0402]
C29  100nF  [CAP_0402]
C30  10nF  [CAP_0201]
C31  10nF  [CAP_0201]
C32  10nF  [CAP_0201]
C33  4.7uF  [CAP_0805]
C34  100nF  [CAP_0402]
C35  100nF  [CAP_0402]
C36  10nF  [CAP_0201]
C37  10nF  [CAP_0201]
C38  10nF  [CAP_0201]
C39  4.7uF  [CAP_0805]
C40  100nF  [CAP_0402]
C41  100nF  [CAP_0402]
C42  10nF  [CAP_0201]
C43  10nF  [CAP_0201]
C44  4.7uF  [CAP_0805]
C45  100nF  [CAP_0402]
C46  100nF  [CAP_0402]
C47  10nF  [CAP_0201]
C48  10nF  [CAP_0201]
C49  10nF  [CAP_0201]
C50  10nF  [CAP_0201]
C51  4.7uF  [CAP_0805]
C52  100nF  [CAP_0402]
C53  100nF  [CAP_0402]
C54  10nF  [CAP_0201]
C55  10nF  [CAP_0201]
C56  10nF  [CAP_0201]
C57  10nF  [CAP_0201]
FB1  MPZ1005S900HT000  Impedance @ Freq: 90Ohms @ 100MHz  Package / Case: 0402  Current Rating: 2.3A  [IND_0402]
FB2  MPZ1005S900HT000  Impedance @ Freq: 90Ohms @ 100MHz  Package / Case: 0402  Current Rating: 2.3A  [IND_0402]
FB3  MPZ1005S900HT000  Impedance @ Freq: 90Ohms @ 100MHz  Package / Case: 0402  Current Rating: 2.3A  [IND_0402]
FB4  MPZ1005S900HT000  Impedance @ Freq: 90Ohms @ 100MHz  Package / Case: 0402  Current Rating: 2.3A  [IND_0402]
FB5  MPZ1005S900HT000  Impedance @ Freq: 90Ohms @ 100MHz  Package / Case: 0402  Current Rating: 2.3A  [IND_0402]
FB6  MPZ1005S900HT000  Impedance @ Freq: 90Ohms @ 100MHz  Package / Case: 0402  Current Rating: 2.3A  [IND_0402]
FB7  MPZ1005S900HT000  Impedance @ Freq: 90Ohms @ 100MHz  Package / Case: 0402  Current Rating: 2.3A  [IND_0402]
FB8  MPZ1005S900HT000  Impedance @ Freq: 90Ohms @ 100MHz  Package / Case: 0402  Current Rating: 2.3A  [IND_0402]
U1  Lattice ECP-5 - LFE5UM-45F-8BG381C  [CABGA-381]  (parts F,G of 7)

### Blocks framed on the sheet
FPGA CORE 1V2: C1-C43 FB1-FB6
FPGA AUX 2V5: C44-C57 FB7 FB8

### Ports
+1V2_FPGA (in), +2V5_FPGA (in), +3V3_FPGA (in), GND (bidir)

### Nets
+1V2_FPGA: C1.1 C2.1 C11.1 C12.1 C21.1 C22.1 C27.1 C28.1 C33.1 C34.1 C39.1 C40.1 FB1.1 FB2.1 FB3.1 FB4.1 FB5.1 FB6.1 ; port +1V2_FPGA
+1V2_FPGA_8: C23.1 C24.1 C25.1 C26.1 FB3.2 U1.J8(VCC) U1.K8(VCC) U1.L8(VCC) U1.M8(VCC)
+1V2_FPGA_13: C29.1 C30.1 C31.1 C32.1 FB4.2 U1.J13(VCC) U1.K13(VCC) U1.L13(VCC) U1.M13(VCC)
+1V2_FPGA_A: C41.1 C42.1 C43.1 FB6.2 U1.T6(VCCA0) U1.T15(VCCA1) U1.U6(VCCA0) U1.U15(VCCA1)
+1V2_FPGA_H: C3.1 C4.1 C5.1 C6.1 C7.1 C8.1 C9.1 C10.1 FB1.2 U1.H8(VCC) U1.H9(VCC) U1.H10(VCC) U1.H11(VCC) U1.H12(VCC) U1.H13(VCC)
+1V2_FPGA_N: C13.1 C14.1 C15.1 C16.1 C17.1 C18.1 C19.1 C20.1 FB2.2 U1.N8(VCC) U1.N9(VCC) U1.N10(VCC) U1.N11(VCC) U1.N12(VCC) U1.N13(VCC)
+1V2_FPGA_TX: C35.1 C36.1 C37.1 C38.1 FB5.2 U1.T7(VCCHTX0_D0CH0) U1.T10(VCCHTX1_D0CH1) U1.T11(VCCHTX0_D1CH0) U1.T14(VCCHTX1_D1CH1)
+2V5_FPGA: C44.1 C45.1 C51.1 C52.1 FB7.1 FB8.1 ; port +2V5_FPGA
+2V5_FPGA_AUX: C46.1 C47.1 C48.1 C49.1 C50.1 FB7.2 U1.F6(VCCAUX) U1.F15(VCCAUX) U1.P6(VCCAUX) U1.P15(VCCAUX)
+2V5_FPGA_AUX_A: C53.1 C54.1 C55.1 C56.1 C57.1 FB8.2 U1.V10(VCCAUXA0) U1.V11(VCCAUXA0) U1.V17(VCCAUXA1) U1.V18(VCCAUXA1)
+3V3_FPGA: U1.P9(VCCIO8) U1.P10(VCCIO8) ; port +3V3_FPGA
GND: C1.2 C2.2 C3.2 C4.2 C5.2 C6.2 C7.2 C8.2 C9.2 C10.2 C11.2 C12.2 C13.2 C14.2 C15.2 C16.2 C17.2 C18.2 C19.2 C20.2 C21.2 C22.2 C23.2 C24.2 C25.2 C26.2 C27.2 C28.2 C29.2 C30.2 C31.2 C32.2 C33.2 C34.2 C35.2 C36.2 C37.2 C38.2 C39.2 C40.2 C41.2 C42.2 C43.2 C44.2 C45.2 C46.2 C47.2 C48.2 C49.2 C50.2 C51.2 C52.2 C53.2 C54.2 C55.2 C56.2 C57.2 U1.B7(GND) U1.B14(GND) U1.C19(GND) U1.D4(GND) U1.F7(GND) U1.F8(GND) U1.F13(GND) U1.F14(GND) U1.G4(GND) U1.G6(GND) U1.G7(GND) U1.G8(GND) U1.G9(GND) U1.G10(GND) U1.G11(GND) U1.G12(GND) U1.G13(GND) U1.G14(GND) U1.G15(GND) U1.G17(GND) U1.H19(GND) U1.J2(GND) U1.J7(GND) U1.J9(GND) U1.J10(GND) U1.J11(GND) U1.J12(GND) U1.J14(GND) U1.K6(GND) U1.K7(GND) U1.K9(GND) U1.K10(GND) U1.K11(GND) U1.K12(GND) U1.K14(GND) U1.K15(GND) U1.L9(GND) U1.L10(GND) U1.L11(GND) U1.L12(GND) U1.M2(GND) U1.M7(GND) U1.M9(GND) U1.M10(GND) U1.M11(GND) U1.M12(GND) U1.M14(GND) U1.M16(GND) U1.N6(GND) U1.N7(GND) U1.N14(GND) U1.N15(GND) U1.P7(GND) U1.P8(GND) U1.P11(GND) U1.P12(GND) U1.P13(GND) U1.P14(GND) U1.R19(GND) U1.U7(GND) U1.U8(GND) U1.U9(GND) U1.U10(GND) U1.U11(GND) U1.U12(GND) U1.U13(GND) U1.U14(GND) U1.V5(GND) U1.V6(GND) U1.V7(GND) U1.V8(GND) U1.V9(GND) U1.V12(GND) U1.V13(GND) U1.V14(GND) U1.V15(GND) U1.V16(GND) U1.V19(GND) U1.V20(GND) U1.W6(GND) U1.W7(GND) U1.W12(GND) U1.W15(GND) U1.W16(GND) U1.W19(GND) ; port GND

Not connected (* = marked no-connect by the designer): U1 F9(VCCIO0) F10(VCCIO0) F11(VCCIO1) F12(VCCIO1) H6(VCCIO7) H7(VCCIO7) H14(VCCIO2) H15(VCCIO2) J6(VCCIO7) J15(VCCIO2) L6(VCCIO6) L7(VCCIO6) L14(VCCIO3) L15(VCCIO3) M6(VCCIO6) M15(VCCIO3) T8(VCCHRX0_D0CH0)* T9(VCCHRX1_D0CH1)* T12(VCCHRX0_D1CH0)* T13(VCCHRX1_D1CH1)*

### Notes on the sheet
- Move 4.7uF after ferrite
- Decouple A powers individually
- Add delay line to FPGA_AUX
  Must be powered on after FPGA_AUXA
- PROJECT
- TITLE
- FILE NAME
- A3
- SIZE
- DWG NO.
- SHEET
- OF
- REV

### Library data of the parts
C1-C57 = CAP_CER: as CX2 on sheet Title; Operating Temperature: *; Tolerance: *; Mfr: *; ComponentLink1Description: Digikey; ComponentLink1URL: [Digikey Link]; Digikey Part No: *; ComponentLink2Description: Datasheet; ComponentLink2URL: [Datasheet Link]
  C1 C11 C21 C27 C33 C39 C44 C51: Footprint: 0805
  C2-C4 C12-C14 C22 C23 C28 C29 C34 C35 C40 C41 C45 C46 C52 C53: Footprint: 0402
  C5-C10 C15-C20 C24-C26 C30-C32 C36-C38 C42 C43 C47-C50 C54-C57: Footprint: 0201
FB1-FB8 = IND_MPZ1005S900HT000: as FB9 on sheet FPGA PERIPHERALS; Operating Temperature: -55C - 125C; Rating: AEC-Q200
U1 = IC_LFE5UM-45F-8BG381C: as U1 on sheet FPGA IO; Operating Temperature: 0C - 85C; Package / Case: 381-CABGA

## Sheet Mechanical and Interconnect.SchDoc: Mechanical & Interconnect
size 420 x 297 mm; Address1: CryptUS; Address3: Pascal-Emmanuel Lachance; SheetNumber: 3; SheetTotal: 12
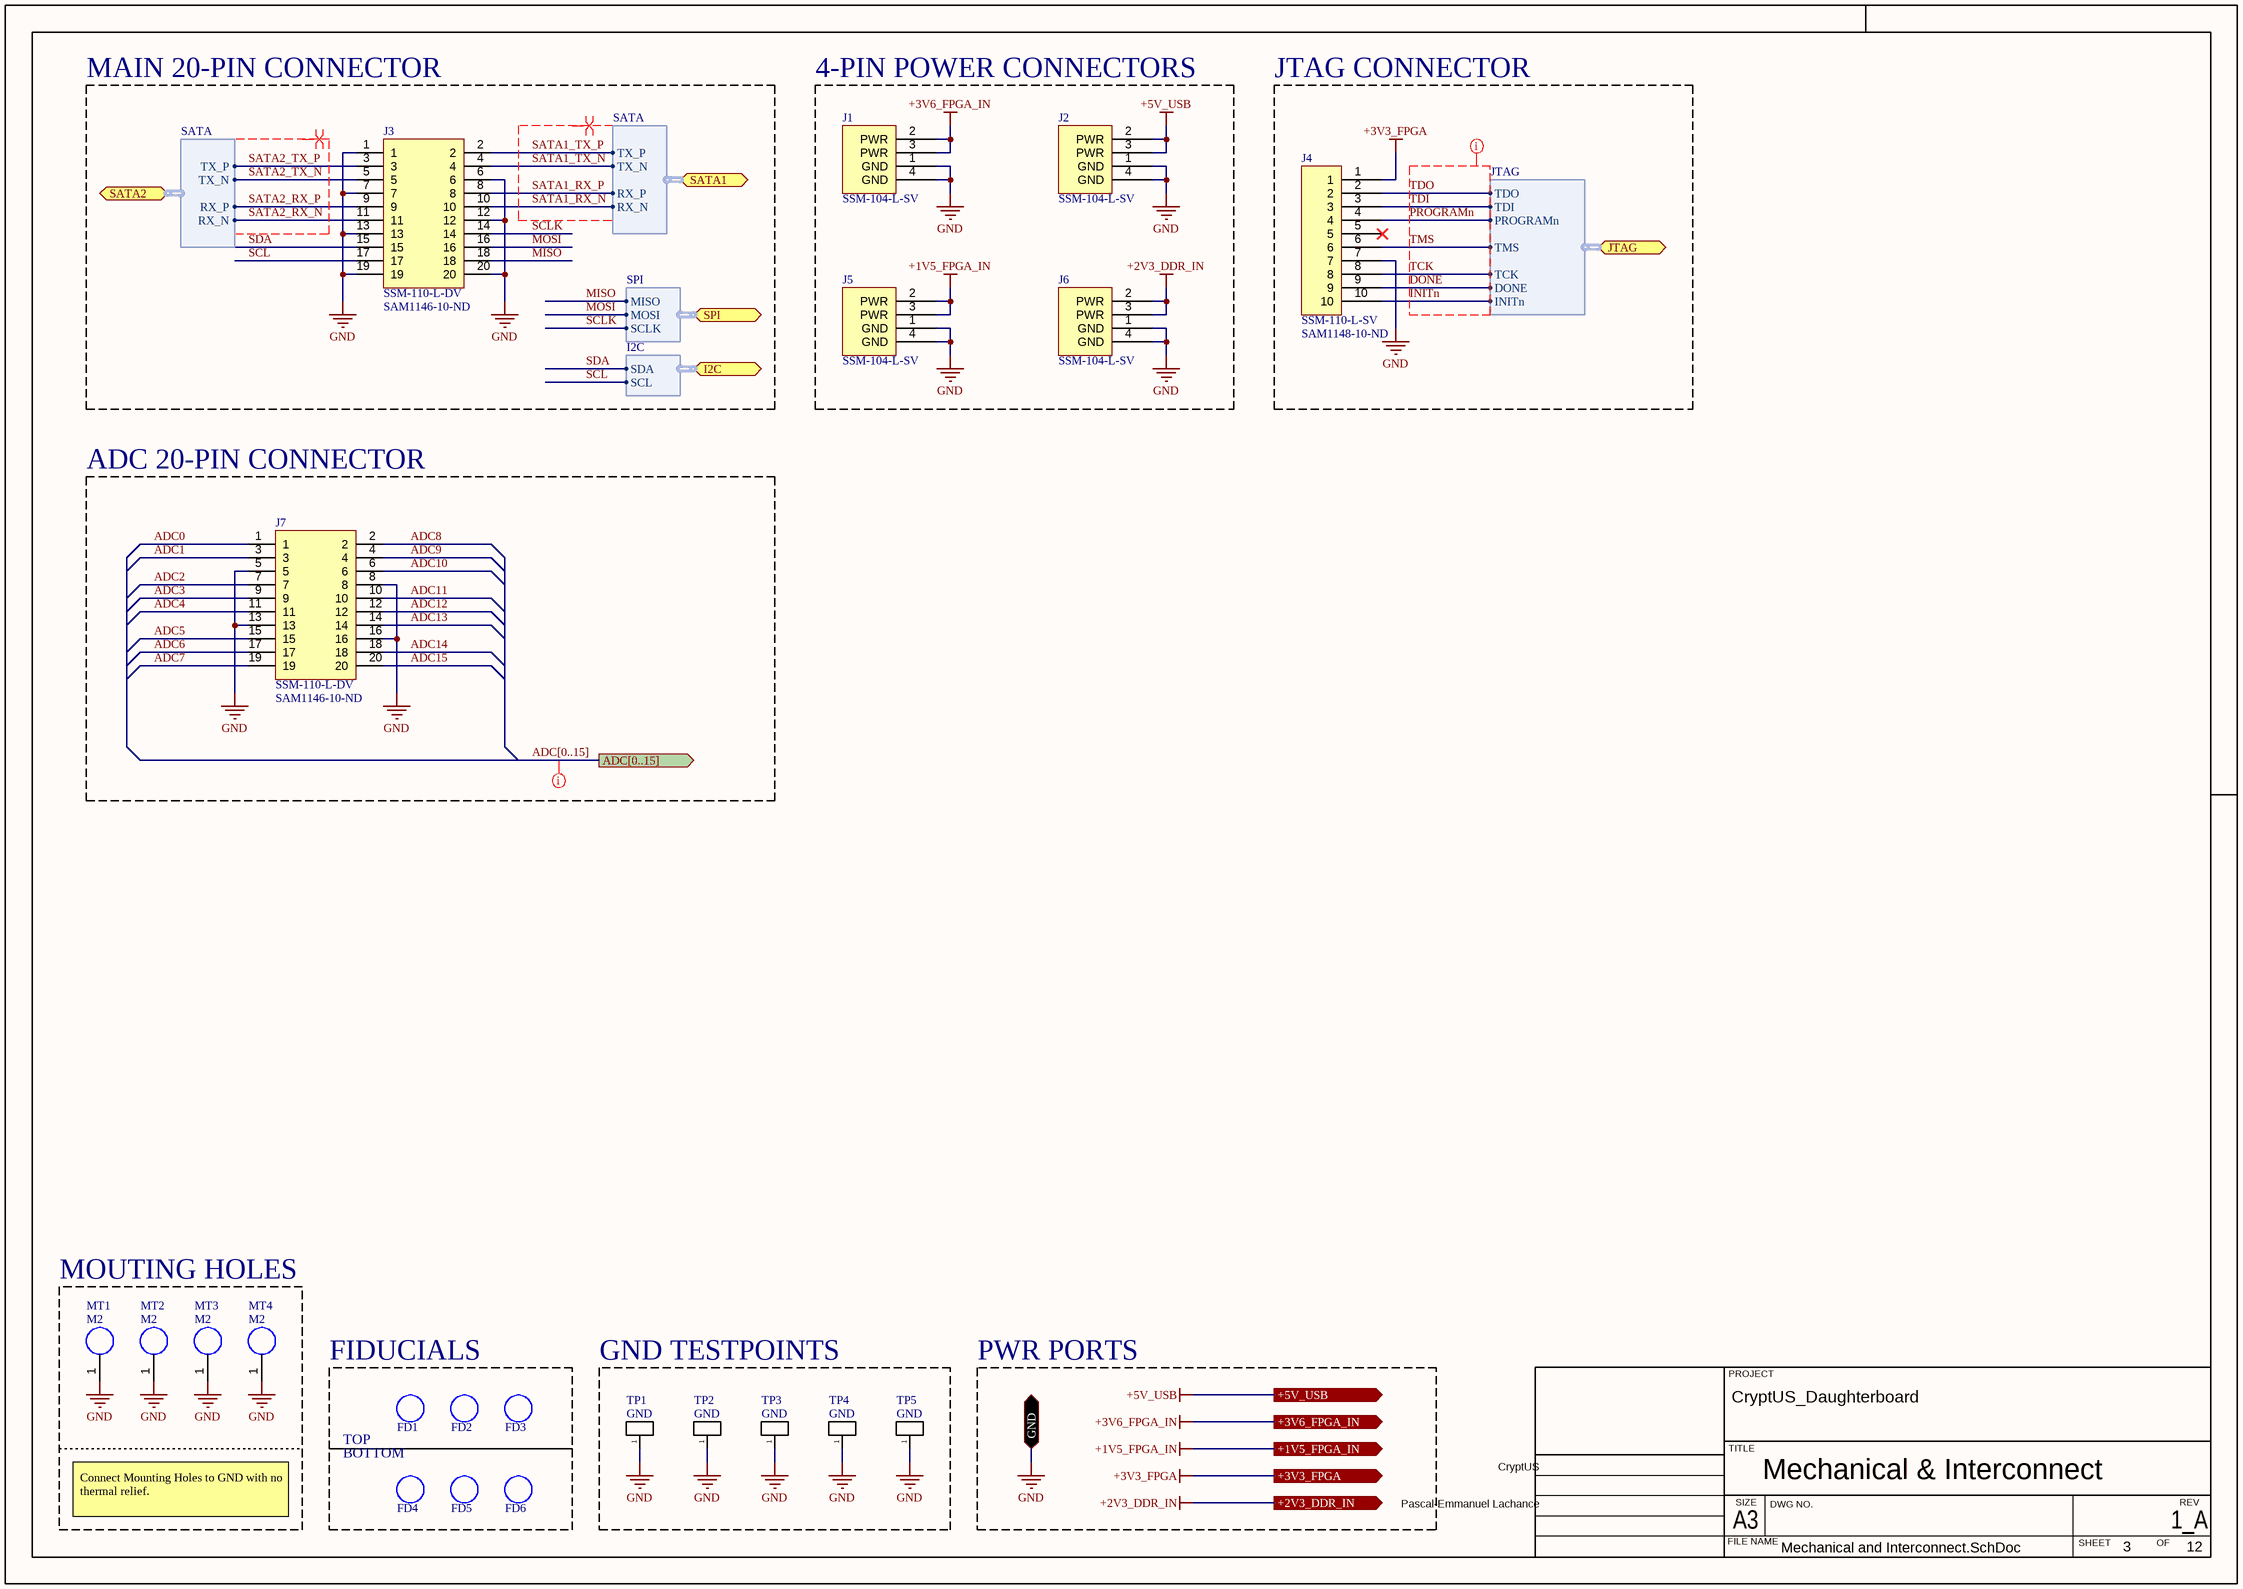
[diagram p6: Mechanical and Interconnect.SchDoc]

### Parts
FD1  FIDUCIAL  [FIDUCIAL]  (value not drawn)  (no BOM)
FD2  FIDUCIAL  [FIDUCIAL]  (value not drawn)  (no BOM)
FD3  FIDUCIAL  [FIDUCIAL]  (value not drawn)  (no BOM)
FD4  FIDUCIAL  [FIDUCIAL]  (value not drawn)  (no BOM)
FD5  FIDUCIAL  [FIDUCIAL]  (value not drawn)  (no BOM)
FD6  FIDUCIAL  [FIDUCIAL]  (value not drawn)  (no BOM)
J1  SSM-104-L-SV  [SSM-104-L-SV]
J2  SSM-104-L-SV  [SSM-104-L-SV]
J3  SSM-110-L-DV  Supplier Part Number 1: SAM1146-10-ND  [SSM-110-L-DV]
J4  SSM-110-L-SV  Supplier Part Number 1: SAM1148-10-ND  [SSM-110-L-SV]
J5  SSM-104-L-SV  [SSM-104-L-SV]
J6  SSM-104-L-SV  [SSM-104-L-SV]
J7  SSM-110-L-DV  Supplier Part Number 1: SAM1146-10-ND  [SSM-110-L-DV]
MT1  M2  [MTH_M2]
MT2  M2  [MTH_M2]
MT3  M2  [MTH_M2]
MT4  M2  [MTH_M2]
TP1  GND  [TP_HOLE]  (no BOM)
TP2  GND  [TP_HOLE]  (no BOM)
TP3  GND  [TP_HOLE]  (no BOM)
TP4  GND  [TP_HOLE]  (no BOM)
TP5  GND  [TP_HOLE]  (no BOM)

### Blocks framed on the sheet
MAIN 20-PIN CONNECTOR: J3
4-PIN POWER CONNECTORS: J1 J2 J5 J6
JTAG CONNECTOR: J4
ADC 20-PIN CONNECTOR: J7
MOUTING HOLES: MT1-MT4
FIDUCIALS: FD1-FD6
GND TESTPOINTS: TP1-TP5

### Ports
+1V5_FPGA_IN (out), +2V3_DDR_IN (out), +3V3_FPGA (out), +3V6_FPGA_IN (out), +5V_USB (out), ADC[0..15] (out), GND (bidir), I2C (bidir, harness I2C), JTAG (bidir, harness JTAG), SATA1 (bidir, harness SATA), SATA2 (bidir, harness SATA), SPI (bidir, harness SPI)

### Harnesses
JTAG: TDO, TDI, PROGRAMn, TMS, TCK, DONE, INITn
SATA: TX_P, TX_N, RX_P, RX_N
SPI: MISO, MOSI, SCLK
I2C: SDA, SCL

### Nets
+1V5_FPGA_IN: J5.2(PWR) J5.3(PWR) ; port +1V5_FPGA_IN
+2V3_DDR_IN: J6.2(PWR) J6.3(PWR) ; port +2V3_DDR_IN
+3V3_FPGA: J4.1 ; port +3V3_FPGA
+3V6_FPGA_IN: J1.2(PWR) J1.3(PWR) ; port +3V6_FPGA_IN
+5V_USB: J2.2(PWR) J2.3(PWR) ; port +5V_USB
GND: J1.1(GND) J1.4(GND) J2.1(GND) J2.4(GND) J3.1 J3.6 J3.7 J3.12 J3.13 J3.19 J3.20 J4.7 J5.1(GND) J5.4(GND) J6.1(GND) J6.4(GND) J7.5 J7.8 J7.13 J7.16 MT1.1 MT2.1 MT3.1 MT4.1 TP1.1(A) TP2.1(A) TP3.1(A) TP4.1(A) TP5.1(A) ; port GND
ADC0: J7.1
ADC1: J7.3
ADC2: J7.7
ADC3: J7.9
ADC4: J7.11
ADC5: J7.15
ADC6: J7.17
ADC7: J7.19
ADC8: J7.2
ADC9: J7.4
ADC10: J7.6
ADC11: J7.10
ADC12: J7.12
ADC13: J7.14
ADC14: J7.18
ADC15: J7.20
DONE: J4.9 ; port JTAG.DONE
INITN: J4.10 ; port JTAG.INITn
MISO: J3.18 ; port SPI.MISO
MOSI: J3.16 ; port SPI.MOSI
PROGRAMN: J4.4 ; port JTAG.PROGRAMn
SATA1_RX_N: J3.10 ; port SATA1.RX_N
SATA1_RX_P: J3.8 ; port SATA1.RX_P
SATA1_TX_N: J3.4 ; port SATA1.TX_N
SATA1_TX_P: J3.2 ; port SATA1.TX_P
SATA2_RX_N: J3.11 ; port SATA2.RX_N
SATA2_RX_P: J3.9 ; port SATA2.RX_P
SATA2_TX_N: J3.5 ; port SATA2.TX_N
SATA2_TX_P: J3.3 ; port SATA2.TX_P
SCL: J3.17 ; port I2C.SCL
SCLK: J3.14 ; port SPI.SCLK
SDA: J3.15 ; port I2C.SDA
TCK: J4.8 ; port JTAG.TCK
TDI: J4.3 ; port JTAG.TDI
TDO: J4.2 ; port JTAG.TDO
TMS: J4.6 ; port JTAG.TMS

Not connected (* = marked no-connect by the designer): J4 5*

### Buses and harness runs
bus ADC[0..15] = port ADC[0..15]

### Layout directives
differential pair; net class SATA: SATA1_RX_N, SATA1_RX_P, SATA1_TX_N, SATA1_TX_P, SATA2_RX_N, SATA2_RX_P, SATA2_TX_N, SATA2_TX_P
net class JTAG: DONE, INITn, PROGRAMn, TCK, TDI, TDO, TMS
net class ADC: (no net found under the mark)

### Notes on the sheet
- PWR PORTS
- (near FD4) BOTTOM
- TOP
- Connect Mounting Holes to GND with no thermal relief.
- PROJECT
- TITLE
- FILE NAME
- A3
- SIZE
- DWG NO.
- SHEET
- OF
- REV

### Library data of the parts
J1 J2 J5 J6 = CONN_SSM-104-L-SV: CONN RCPT 4POS 0.1 GOLD SMD; Mfr: Samtec Inc.; Number of positions: 4; Pitch: 100mil; Current: 5.2A / contact; Insulation Height: 290mil; Operating Temperature: -55C - 125C
J3 J7 = CONN_SSM-110-L-DV: Mfr: Samtech Inc.; Number of positions: 20; Pitch: 100mils; Current Rating: 5.2A per contact; Voltage Rating: 405VAC, 572VDC; Number of rows: 2; Mounting Type: Surface Mount; Insulation Height: 290mils; Operating Temperature: -55C - 125C; Supplier 1: Digi-Key
J4 = CONN_SSM-110-L-SV: CONN RCPT 10POS 0.1 GOLD SMD; Mfr: Samtec Inc.; Number of positions: 10; Pitch: 100mil; Current: 5.2A / contact; Insulation Height: 290mil; Operating Temperature: -55C - 125C; Supplier 1: Digi-Key
MT1-MT4 = MOUNTING_HOLE
TP1-TP5 = TESTPOINT: Test Point

## Sheet DDR3 Regulators.SchDoc
size A3; SheetNumber: 10; SheetTotal: 12
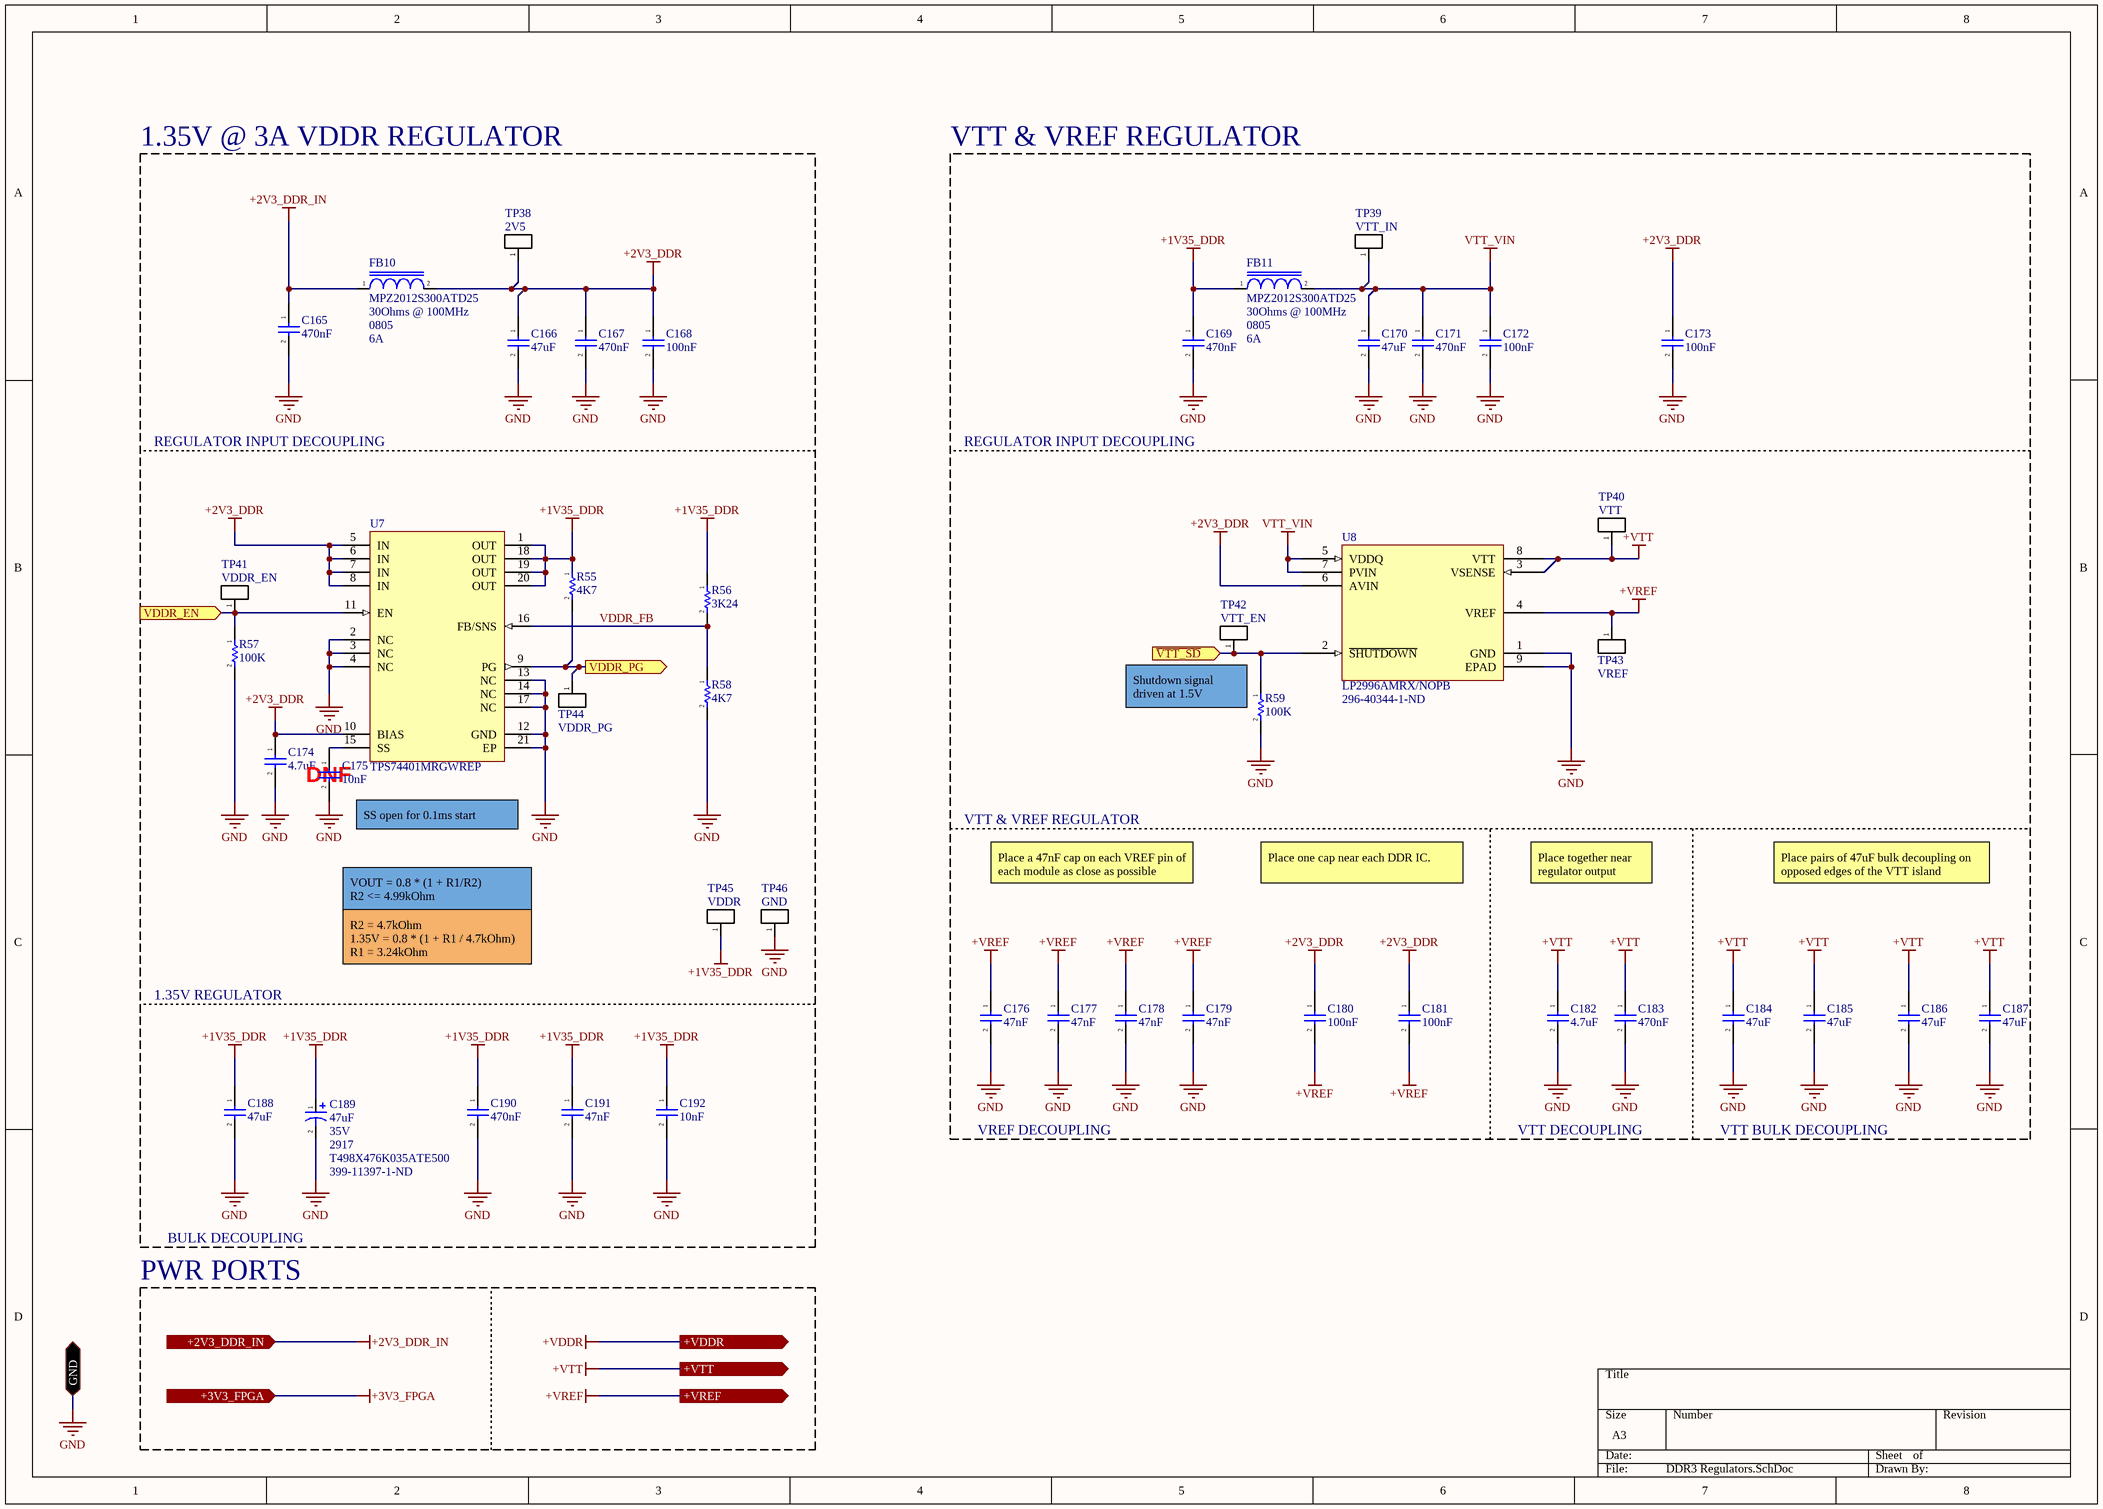
[diagram p7: DDR3 Regulators.SchDoc]

### Parts
C165  470nF  [CAP_0402]
C166  47uF  [CAP_1206]
C167  470nF  [CAP_0402]
C168  100nF  [CAP_0402]
C169  470nF  [CAP_0402]
C170  47uF  [CAP_1206]
C171  470nF  [CAP_0402]
C172  100nF  [CAP_0402]
C173  100nF  [CAP_0402]
C174  4.7uF  [CAP_0805]
C175  10nF  [CAP_0201]
C176  47nF  [CAP_0201]
C177  47nF  [CAP_0201]
C178  47nF  [CAP_0201]
C179  47nF  [CAP_0201]
C180  100nF  [CAP_0402]
C181  100nF  [CAP_0402]
C182  4.7uF  [CAP_0805]
C183  470nF  [CAP_0402]
C184  47uF  [CAP_1206]
C185  47uF  [CAP_1206]
C186  47uF  [CAP_1206]
C187  47uF  [CAP_1206]
C188  47uF  [CAP_1206]
C189  47uF  Part #: T498X476K035ATE500  Rated Voltage: 35V  Supplier Part Number 1: 399-11397-1-ND  Package: 2917  [CAP_2917_P]
C190  470nF  [CAP_0402]
C191  47nF  [CAP_0201]
C192  10nF  [CAP_0201]
FB10  MPZ2012S300ATD25  Impedance @ Freq: 30Ohms @ 100MHz  Package / Case: 0805  Current Rating: 6A  [IND_0805]
FB11  MPZ2012S300ATD25  Impedance @ Freq: 30Ohms @ 100MHz  Package / Case: 0805  Current Rating: 6A  [IND_0805]
R55  4K7  [RES_0603]
R56  3K24  [RES_0603]
R57  100K  [RES_0603]
R58  4K7  [RES_0603]
R59  100K  [RES_0603]
TP38  2V5  [TP_HOLE]  (no BOM)
TP39  VTT_IN  [TP_PAD]  (no BOM)
TP40  VTT  [TP_PAD]  (no BOM)
TP41  VDDR_EN  [TP_PAD_TINY]  (no BOM)
TP42  VTT_EN  [TP_PAD_TINY]  (no BOM)
TP43  VREF  [TP_PAD]  (no BOM)
TP44  VDDR_PG  [TP_PAD_TINY]  (no BOM)
TP45  VDDR  [TP_HOLE]  (no BOM)
TP46  GND  [TP_PAD_SMALL]  (no BOM)
U7  TPS74401MRGWREP  [TPS74401]
U8  LP2996AMRX/NOPB  Supplier Part Number 1: 296-40344-1-ND  [LP2996AMRX]

### Blocks framed on the sheet
1.35V @ 3A VDDR REGULATOR: C165-C168 C174 C175 C188-C192 FB10 R55-R58 TP38 TP41 TP44-TP46 U7
VTT & VREF REGULATOR: C169-C173 C176-C187 FB11 R59 TP39 TP40 TP42 TP43 U8

### Ports
+2V3_DDR_IN (in), +3V3_FPGA (in), +VDDR (out), +VREF (out), +VTT (out), GND (bidir), VDDR_EN (in), VDDR_PG (out), ~{VTT_SD} (in)

### Nets
+1V35_DDR: C169.1 C188.1 C189.1 C190.1 C191.1 C192.1 FB11.1 R55.1 R56.1 TP45.1(A) U7.1(OUT) U7.18(OUT) U7.19(OUT) U7.20(OUT)
+2V3_DDR: C166.1 C167.1 C168.1 C173.1 C174.1 C180.1 C181.1 FB10.2 TP38.1(A) U7.5(IN) U7.6(IN) U7.7(IN) U7.8(IN) U7.10(BIAS) U8.6(AVIN)
+2V3_DDR_IN: C165.1 FB10.1 ; port +2V3_DDR_IN
+VREF: C176.1 C177.1 C178.1 C179.1 C180.2 C181.2 TP43.1(A) U8.4(VREF) ; port +VREF
+VTT: C182.1 C183.1 C184.1 C185.1 C186.1 C187.1 TP40.1(A) U8.3(VSENSE) U8.8(VTT) ; port +VTT
GND: C165.2 C166.2 C167.2 C168.2 C169.2 C170.2 C171.2 C172.2 C173.2 C174.2 C175.2 C176.2 C177.2 C178.2 C179.2 C182.2 C183.2 C184.2 C185.2 C186.2 C187.2 C188.2 C189.2 C190.2 C191.2 C192.2 R57.2 R58.2 R59.2 TP46.1(A) U7.2(NC) U7.3(NC) U7.4(NC) U7.12(GND) U7.13(NC) U7.14(NC) U7.17(NC) U7.21(EP) U8.1(GND) U8.9(EPAD) ; port GND
VTT_VIN: C170.1 C171.1 C172.1 FB11.2 TP39.1(A) U8.5(VDDQ) U8.7(PVIN)
VDDR_FB: R56.2 R58.1 U7.16(FB/SNS)
NetC175_1: C175.1 U7.15(SS)
NetR55_2: R55.2 TP44.1(A) U7.9(PG) ; port VDDR_PG
NetR57_1: R57.1 TP41.1(A) U7.11(EN) ; port VDDR_EN
NetR59_1: R59.1 TP42.1(A) U8.2(~{SHUTDOWN}) ; port ~{VTT_SD}

### Notes on the sheet
- REGULATOR INPUT DECOUPLING
- (near R59) Shutdown signal driven at 1.5V
- (near C175) SS open for 0.1ms start
- VTT & VREF REGULATOR
- VOUT = 0.8 * (1 + R1/R2)
  R2 <= 4.99kOhm
- Place a 47nF cap on each VREF pin of each module as close as possible
- Place one cap near each DDR IC.
- Place together near regulator output
- Place pairs of 47uF bulk decoupling on opposed edges of the VTT island
- R2 = 4.7kOhm
  1.35V = 0.8 * (1 + R1 / 4.7kOhm)
  R1 = 3.24kOhm
- 1.35V REGULATOR
- VREF DECOUPLING
- VTT DECOUPLING
- VTT BULK DECOUPLING
- BULK DECOUPLING
- PWR PORTS

### Library data of the parts
C165-C188 C190-C192 = CAP_CER: as CX2 on sheet Title; Operating Temperature: *; Tolerance: *; Mfr: *; ComponentLink1Description: Digikey; ComponentLink1URL: [Digikey Link]; Digikey Part No: *; ComponentLink2Description: Datasheet; ComponentLink2URL: [Datasheet Link]
  C165 C167-C169 C171-C173 C180 C181 C183 C190: Footprint: 0402
  C166 C170 C184-C188: Footprint: 1206
  C174 C182: Footprint: 0805
  C175-C179 C191 C192: Footprint: 0201
C189 = CAP_T498X476K035ATE500: as CX1 on sheet Title; Operating Temperature: -55C - 150C; Supplier 1: Digi-Key
FB10 FB11 = IND_MPZ2012S300ATD25: 30 Ohms @ 100 MHz 1 Power Line Ferrite Bead 0805 (2012 Metric) 6A 10mOhm; Resistance: 10mOhms; Operating Temperature: -55C - 125C; Rating: AEC-Q200
R55 R57-R59 = RESISTOR: Power: 1/16W; Tolerance: 10%; Automotive: *; Operating Temperature: *; # Digikey: *; ComponentLink1Description: Digikey; ComponentLink1URL: *; # Manufacturer: *; Package / Case: 0603
R56 = RESISTOR: Power: 1/16W; Tolerance: 2%; Automotive: *; Operating Temperature: *; # Digikey: *; ComponentLink1Description: Digikey; ComponentLink1URL: *; # Manufacturer: *; Package / Case: 0603
TP38-TP46 = TESTPOINT: Test Point
U7 = IC_TPS47701: IC REG LINEAR POS ADJ 3A 20VQFN; Mfr: Texas Instruments; Input Voltage (min): 240mV; Input Voltage (max): 5.5V; Output Voltage (min): 0.8V; Output Voltage (max): 3.6V; PSRR: 73dB - 50dB; Current: 3A; Operating Temperature: -55C - 125C; Package / Case: 20-VQFN; Digikey Part Number: 296-27227-1-ND; Voltage Dropout (max): 240mV; ComponentLink1Description: Digikey; ComponentLink1URL: https://www.digikey.ca/en/products/detail/texas-instruments/TPS74401MRGWREP/2261531; ComponentLink2Description: Datasheet; ComponentLink2URL: https://www.ti.com/lit/ds/symlink/tps74401-ep.pdf
U8 = IC_LP2996AMRX: IC REGULATOR DDR TERM 8SOPWRPAD; Mfr: Texas Instruments; Supply Voltage: 2.2V - 5.5V; Continuous Current: 1.5A; Applications: DDR3 Terminator; Operating Temperature: 0C - 125C; Supplier 1: Digi-Key

## Sheet DDR3 Power.SchDoc
size A3; SheetNumber: 9; SheetTotal: 12
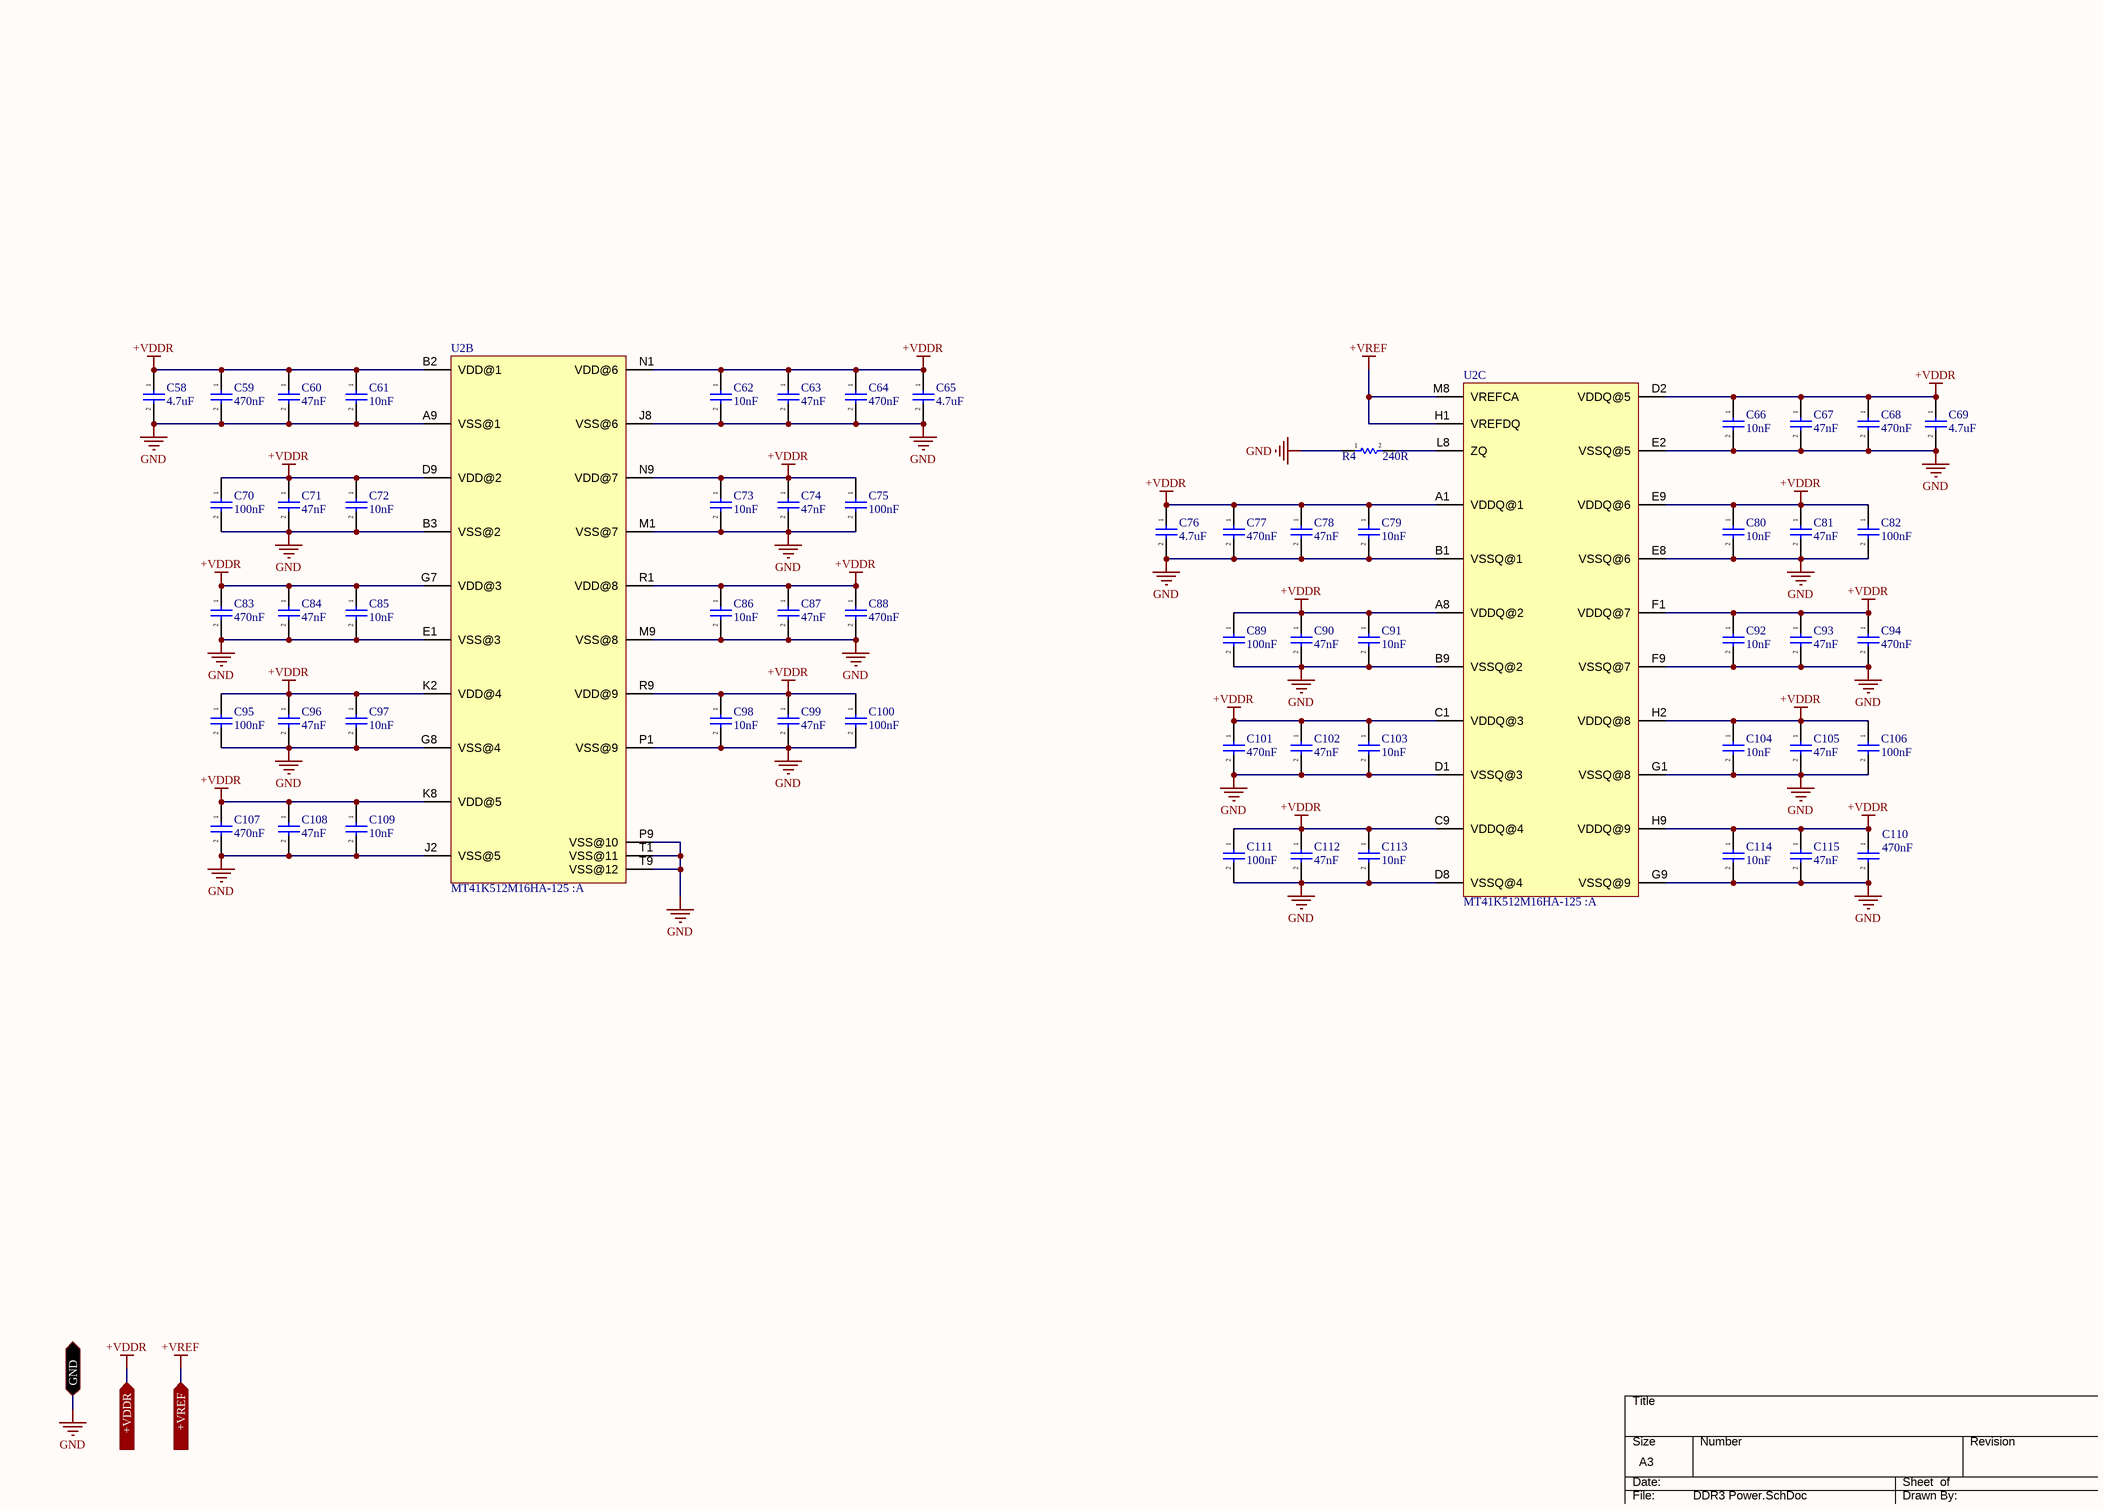
[diagram p8: DDR3 Power.SchDoc]

### Parts
C58  4.7uF  [CAP_0805]
C59  470nF  [CAP_0402]
C60  47nF  [CAP_0201]
C61  10nF  [CAP_0201]
C62  10nF  [CAP_0201]
C63  47nF  [CAP_0201]
C64  470nF  [CAP_0402]
C65  4.7uF  [CAP_0805]
C66  10nF  [CAP_0201]
C67  47nF  [CAP_0201]
C68  470nF  [CAP_0402]
C69  4.7uF  [CAP_0805]
C70  100nF  [CAP_0402]
C71  47nF  [CAP_0201]
C72  10nF  [CAP_0201]
C73  10nF  [CAP_0201]
C74  47nF  [CAP_0201]
C75  100nF  [CAP_0402]
C76  4.7uF  [CAP_0805]
C77  470nF  [CAP_0402]
C78  47nF  [CAP_0201]
C79  10nF  [CAP_0201]
C80  10nF  [CAP_0201]
C81  47nF  [CAP_0201]
C82  100nF  [CAP_0402]
C83  470nF  [CAP_0402]
C84  47nF  [CAP_0201]
C85  10nF  [CAP_0201]
C86  10nF  [CAP_0201]
C87  47nF  [CAP_0201]
C88  470nF  [CAP_0402]
C89  100nF  [CAP_0402]
C90  47nF  [CAP_0201]
C91  10nF  [CAP_0201]
C92  10nF  [CAP_0201]
C93  47nF  [CAP_0201]
C94  470nF  [CAP_0402]
C95  100nF  [CAP_0402]
C96  47nF  [CAP_0201]
C97  10nF  [CAP_0201]
C98  10nF  [CAP_0201]
C99  47nF  [CAP_0201]
C100  100nF  [CAP_0402]
C101  470nF  [CAP_0402]
C102  47nF  [CAP_0201]
C103  10nF  [CAP_0201]
C104  10nF  [CAP_0201]
C105  47nF  [CAP_0201]
C106  100nF  [CAP_0402]
C107  470nF  [CAP_0402]
C108  47nF  [CAP_0201]
C109  10nF  [CAP_0201]
C110  470nF  [CAP_0402]
C111  100nF  [CAP_0402]
C112  47nF  [CAP_0201]
C113  10nF  [CAP_0201]
C114  10nF  [CAP_0201]
C115  47nF  [CAP_0201]
R4  240R  [RES_0402]
U2  MT41K512M16HA-125 :A  [FBGA-96]  (parts B,C of 3)

### Ports
+VDDR (in), +VREF (in), GND (bidir)

### Nets
+VDDR: C58.1 C59.1 C60.1 C61.1 C62.1 C63.1 C64.1 C65.1 C66.1 C67.1 C68.1 C69.1 C70.1 C71.1 C72.1 C73.1 C74.1 C75.1 C76.1 C77.1 C78.1 C79.1 C80.1 C81.1 C82.1 C83.1 C84.1 C85.1 C86.1 C87.1 C88.1 C89.1 C90.1 C91.1 C92.1 C93.1 C94.1 C95.1 C96.1 C97.1 C98.1 C99.1 C100.1 C101.1 C102.1 C103.1 C104.1 C105.1 C106.1 C107.1 C108.1 C109.1 C110.1 C111.1 C112.1 C113.1 C114.1 C115.1 U2.A1(VDDQ@1) U2.A8(VDDQ@2) U2.B2(VDD@1) U2.C1(VDDQ@3) U2.C9(VDDQ@4) U2.D2(VDDQ@5) U2.D9(VDD@2) U2.E9(VDDQ@6) U2.F1(VDDQ@7) U2.G7(VDD@3) U2.H2(VDDQ@8) U2.H9(VDDQ@9) U2.K2(VDD@4) U2.K8(VDD@5) U2.N1(VDD@6) U2.N9(VDD@7) U2.R1(VDD@8) U2.R9(VDD@9) ; port +VDDR
+VREF: U2.H1(VREFDQ) U2.M8(VREFCA) ; port +VREF
GND: C58.2 C59.2 C60.2 C61.2 C62.2 C63.2 C64.2 C65.2 C66.2 C67.2 C68.2 C69.2 C70.2 C71.2 C72.2 C73.2 C74.2 C75.2 C76.2 C77.2 C78.2 C79.2 C80.2 C81.2 C82.2 C83.2 C84.2 C85.2 C86.2 C87.2 C88.2 C89.2 C90.2 C91.2 C92.2 C93.2 C94.2 C95.2 C96.2 C97.2 C98.2 C99.2 C100.2 C101.2 C102.2 C103.2 C104.2 C105.2 C106.2 C107.2 C108.2 C109.2 C110.2 C111.2 C112.2 C113.2 C114.2 C115.2 R4.1 U2.A9(VSS@1) U2.B1(VSSQ@1) U2.B3(VSS@2) U2.B9(VSSQ@2) U2.D1(VSSQ@3) U2.D8(VSSQ@4) U2.E1(VSS@3) U2.E2(VSSQ@5) U2.E8(VSSQ@6) U2.F9(VSSQ@7) U2.G1(VSSQ@8) U2.G8(VSS@4) U2.G9(VSSQ@9) U2.J2(VSS@5) U2.J8(VSS@6) U2.M1(VSS@7) U2.M9(VSS@8) U2.P1(VSS@9) U2.P9(VSS@10) U2.T1(VSS@11) U2.T9(VSS@12) ; port GND
NetR4_2: R4.2 U2.L8(ZQ)

### Notes on the sheet
- DWG NO:
- REV:
- THIS DOCUMENT AND THE DATA DISCLOSED HEREIN OR
- HEREWITH IS THE PROPERTY OF ALTIUM LIMITED AND MAY
- BE FREELY DISTRIBUTED IN WHOLE. NO RIGHTS ARE
- RESERVED OR EXPRESS OR IMPLIED WARANTEE GIVEN.
- REVISION
- DESCRIPTION
- DATE
- APPROVED
- ENG:
- APPROVALS
- PROJECT
- DSN:
- CHK:
- REFERENCE DOCUMENTS
- PROJECT REVISION:
- TITLE
- DOCUMENT REVISION:
- DESIGN ITEM:
- BOM:
- FAB DWG:
- PCB DWG:
- ASSY DWG:
- SCALE:
- FILE NAME
- A2
- SIZE
- CAGE CODE
- DWG NO.
- SHEET
- OF
- REV

### Library data of the parts
C58-C115 = CAP_CER: as CX2 on sheet Title; Operating Temperature: *; Tolerance: *; Mfr: *; ComponentLink1Description: Digikey; ComponentLink1URL: [Digikey Link]; Digikey Part No: *; ComponentLink2Description: Datasheet; ComponentLink2URL: [Datasheet Link]
  C58 C65 C69 C76: Footprint: 0805
  C59 C64 C68 C70 C75 C77 C82 C83 C88 C89 C94 C95 C100 C101 C106 C107 C110 C111: Footprint: 0402
  C60-C63 C66 C67 C71-C74 C78-C81 C84-C87 C90-C93 C96-C99 C102-C105 C108 C109 C112-C115: Footprint: 0201
R4 = RESISTOR: Power: 1/8W; Tolerance: 1%; Automotive: *; Operating Temperature: *; # Digikey: *; ComponentLink1Description: Digikey; ComponentLink1URL: *; # Manufacturer: *; Package / Case: 0402
U2 = IC_MT41K512M16HA-125: DRAM 8G 1.35V 512Mx16 800 MHz DDR3 0C-90C; Mfr: Alliance Memory; Data Bus Width: 16 bits; Memory Size: 8Gb; Maximum Clock Frequency: 800MHz; Supply Voltage (Max): 1.45V; Supply Voltage (Min): 1.283V; Supply Current (Max): 88mA; Package / Case: FBGA-96; Type: SDRAM - DDR3L; Memory Organization: 512M x 16; Operating Temperature: 0C - 95C

## Sheet DDR3.SchDoc
size 420 x 297 mm; SheetNumber: 8; SheetTotal: 12
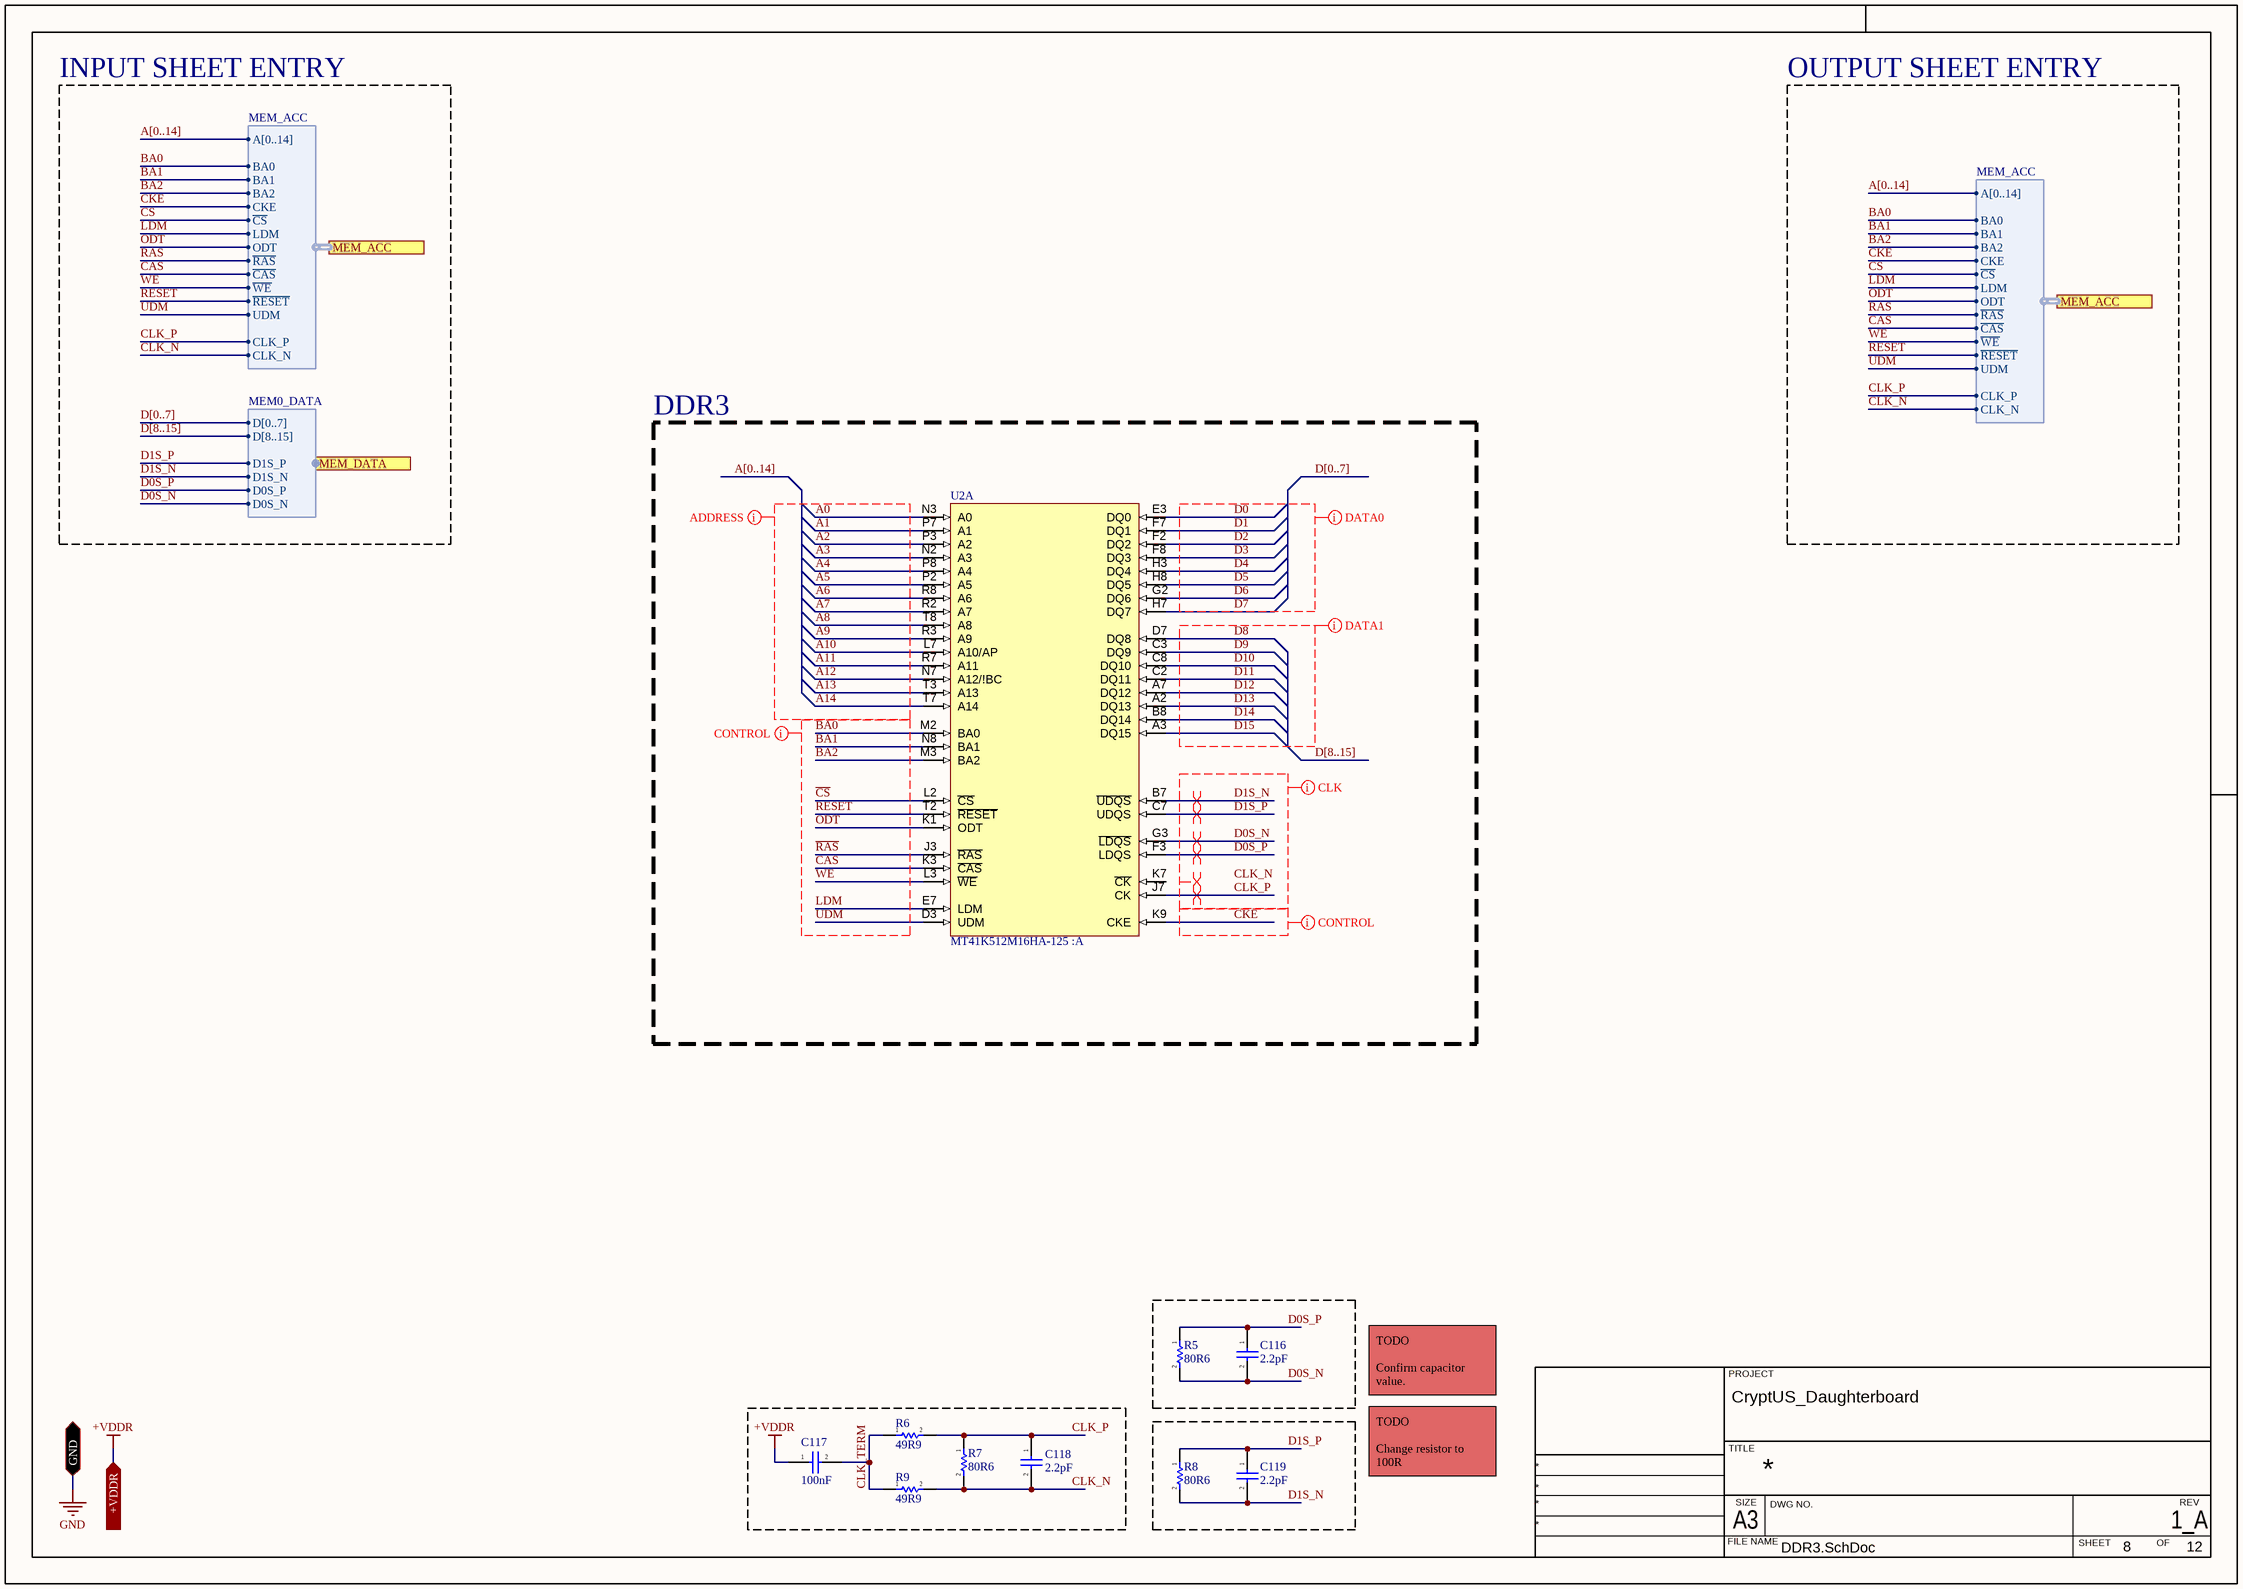
[diagram p9: DDR3.SchDoc]

### Parts
C116  2.2pF  [CAP_0402]
C117  100nF  [CAP_0402]
C118  2.2pF  [CAP_0402]
C119  2.2pF  [CAP_0402]
R5  80R6  [RES_0402]
R6  49R9  [RES_0402]
R7  80R6  [RES_0402]
R8  80R6  [RES_0402]
R9  49R9  [RES_0402]
U2  MT41K512M16HA-125 :A  [FBGA-96]  (part A of 3)

### Blocks framed on the sheet
DDR3: U2

### Ports
+VDDR (in), GND (bidir), MEM_ACC (harness MEM_ACC), MEM_DATA (harness MEM0_DATA)

### Harnesses
MEM_ACC: BA0, BA1, BA2, CKE, ~{CS}, LDM, ODT, ~{RAS}, ~{CAS}, ~{WE}, ~{RESET}, UDM, CLK_N, CLK_P, A[0..14]
MEM0_DATA: D[8..15], D0S_N, D0S_P, D1S_N, D1S_P, D[0..7]

### Nets
+VDDR: C117.1 ; port +VDDR
~{CAS}: U2.K3(~{CAS}) ; port MEM_ACC.~{CAS}
~{CS}: U2.L2(~{CS}) ; port MEM_ACC.~{CS}
~{RAS}: U2.J3(~{RAS}) ; port MEM_ACC.~{RAS}
~{RESET}: U2.T2(~{RESET}) ; port MEM_ACC.~{RESET}
~{WE}: U2.L3(~{WE}) ; port MEM_ACC.~{WE}
A0: U2.N3(A0)
A1: U2.P7(A1)
A2: U2.P3(A2)
A3: U2.N2(A3)
A4: U2.P8(A4)
A5: U2.P2(A5)
A6: U2.R8(A6)
A7: U2.R2(A7)
A8: U2.T8(A8)
A9: U2.R3(A9)
A10: U2.L7(A10/AP)
A11: U2.R7(A11)
A12: U2.N7(A12/!BC)
A13: U2.T3(A13)
A14: U2.T7(A14)
BA0: U2.M2(BA0) ; port MEM_ACC.BA0
BA1: U2.N8(BA1) ; port MEM_ACC.BA1
BA2: U2.M3(BA2) ; port MEM_ACC.BA2
CKE: U2.K9(CKE) ; port MEM_ACC.CKE
CLK_N: C118.2 R7.2 R9.2 ; port MEM_ACC.CLK_N
CLK_P: C118.1 R6.2 R7.1 U2.J7(CK) ; port MEM_ACC.CLK_P
CLK_TERM: C117.2 R6.1 R9.1
D0: U2.E3(DQ0)
D0S_N: C116.2 R5.2 U2.G3(~{LDQS}) ; port MEM_DATA.D0S_N
D0S_P: C116.1 R5.1 U2.F3(LDQS) ; port MEM_DATA.D0S_P
D1: U2.F7(DQ1)
D1S_N: C119.2 R8.2 U2.B7(~{UDQS}) ; port MEM_DATA.D1S_N
D1S_P: C119.1 R8.1 U2.C7(UDQS) ; port MEM_DATA.D1S_P
D2: U2.F2(DQ2)
D3: U2.F8(DQ3)
D4: U2.H3(DQ4)
D5: U2.H8(DQ5)
D6: U2.G2(DQ6)
D7: U2.H7(DQ7)
D8: U2.D7(DQ8)
D9: U2.C3(DQ9)
D10: U2.C8(DQ10)
D11: U2.C2(DQ11)
D12: U2.A7(DQ12)
D13: U2.A2(DQ13)
D14: U2.B8(DQ14)
D15: U2.A3(DQ15)
LDM: U2.E7(LDM) ; port MEM_ACC.LDM
ODT: U2.K1(ODT) ; port MEM_ACC.ODT
UDM: U2.D3(UDM) ; port MEM_ACC.UDM

Not connected (* = marked no-connect by the designer): U2 K7(~{CK})

### Buses and harness runs
bus A[0..14]
bus D[0..7]
bus D[8..15]

### Layout directives
net class ACC; net class ADDRESS: A0, A1, A2, A3, A4, A5, A6, A7, A8, A9, A10, A11, A12, A13, A14
net class ACC; net class CONTROL: BA0, BA1, BA2, CKE, LDM, ODT, UDM, ~{CAS}, ~{CS}, ~{RAS}, ~{RESET}, ~{WE}
net class CLK; net class ACC: CLK_N, CLK_P, D0S_N, D0S_P, D1S_N, D1S_P
net class DATA; net class DATA0: D0, D1, D2, D3, D4, D5, D6, D7
net class DATA; net class DATA1: D8, D9, D10, D11, D12, D13, D14, D15
differential pair: CLK_N, CLK_P, D0S_N, D0S_P, D1S_N, D1S_P

### Notes on the sheet
- INPUT SHEET ENTRY
- OUTPUT SHEET ENTRY
- TODO
  Confirm capacitor value.
- TODO
  Change resistor to 100R
- Labels drawn without touching a wire or pin: CLK_N
- PROJECT
- TITLE
- FILE NAME
- A3
- SIZE
- DWG NO.
- SHEET
- OF
- REV

### Library data of the parts
C116-C119 = CAP_CER: as CX2 on sheet Title; Operating Temperature: *; Tolerance: *; Mfr: *; ComponentLink1Description: Digikey; ComponentLink1URL: [Digikey Link]; Digikey Part No: *; ComponentLink2Description: Datasheet; ComponentLink2URL: [Datasheet Link]; Footprint: 0402
R5-R9 = RESISTOR: Power: 1/8W; Tolerance: 0.5%; Automotive: *; Operating Temperature: *; Package / Case: 0402; # Digikey: *; ComponentLink1Description: Digikey; ComponentLink1URL: *; # Manufacturer: *
U2 = IC_MT41K512M16HA-125: as U2 on sheet DDR3 Power; Package / Case: FBGA-96; Type: SDRAM - DDR3L; Memory Organization: 512M x 16; Operating Temperature: 0C - 95C